# EAGLE design ETHERUNO (EAGLE 9.6.2)

## Sheet 1 of 4
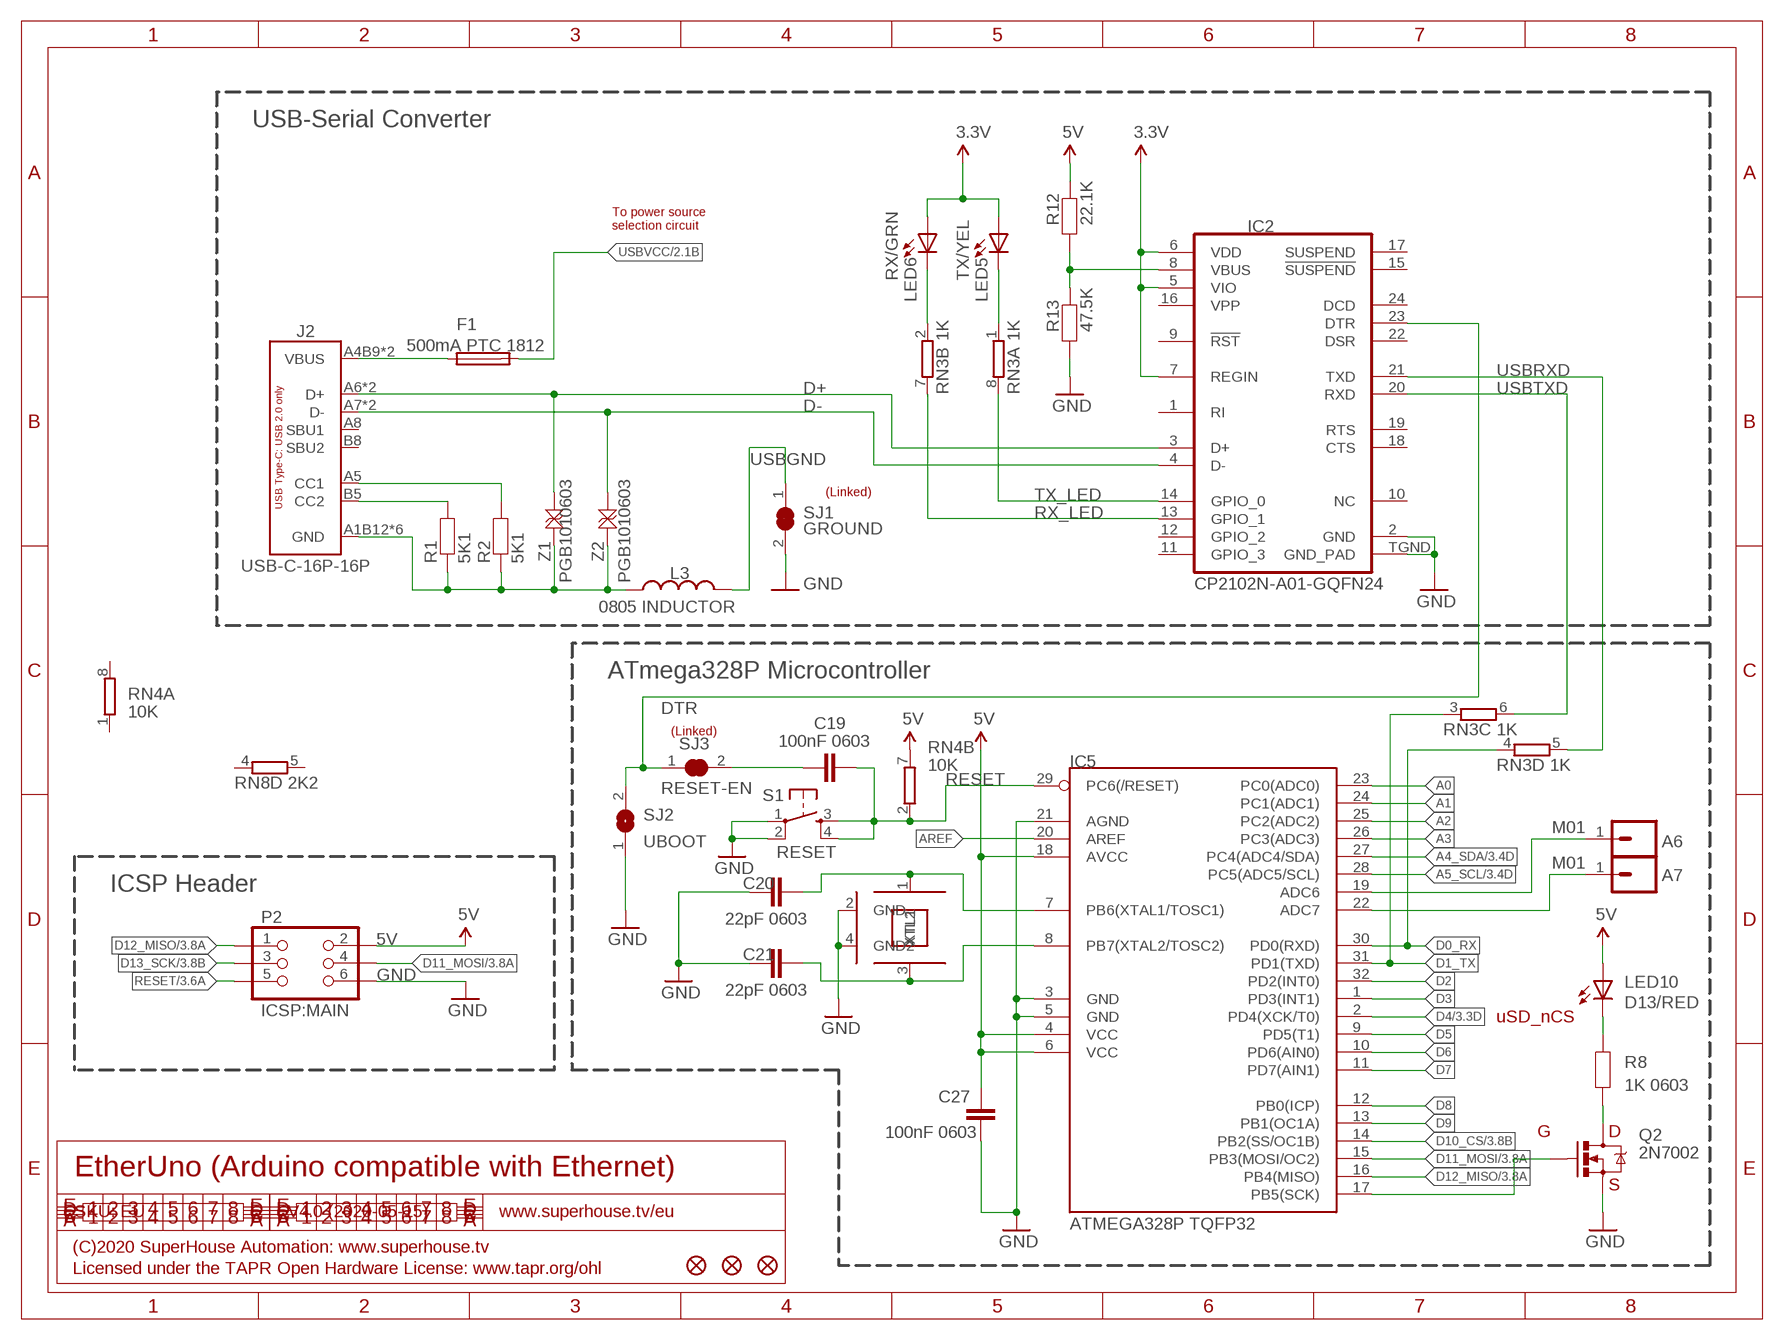
[diagram p0: schematic, sheet 1]

### Parts
A6  M01  M01-PLAIN  [1X01]
A7  M01  M01-PLAIN  [1X01]
C19  100nF 0603  CAP0603  [C0603]
C20  22pF 0603  CAP0603  [C0603]
C21  22pF 0603  CAP0603  [C0603]
C27  100nF 0603  CAP0603  [C0603]
F1  500mA PTC 1812  PTC050  [1812]
FID1  FIDUCIAL1X2.5  [FIDUCIAL-1X2.5]
FID2  FIDUCIAL1X2.5  [FIDUCIAL-1X2.5]
FID3  FIDUCIAL1X2.5  [FIDUCIAL-1X2.5]
IC2  CP2102N-A01-GQFN24  CP2104  [QFN-24]
IC5  ATMEGA328P TQFP32  ATMEGA8-AI  [TQFP32-08]
J2  USB-C-16P-16P  [USB-C-16P]
L3  0805 INDUCTOR  INDUCTOR0805-LARGE  [0805-LARGE]
LED5  TX/YEL  LED0603  [LED-0603]
LED6  RX/GRN  LED0603  [LED-0603]
LED10  D13/RED  LED0603  [LED-0603]
P2  ICSP:MAIN  ICSP-PIN  [2X03-ICSP]
Q2  2N7002  MOSFET-NCHANNEL-233  [SOT23-3]
R1  5K1  RESISTOR0603  [R0603]
R2  5K1  RESISTOR0603  [R0603]
R8  1K 0603  RESISTOR0603  [R0603]
R12  22.1K  RESISTOR0603  [R0603]
R13  47.5K  RESISTOR0603  [R0603]
RN3  1K  4R-NCAY16  [CAY16]
RN4  10K  4R-NCAY16  [CAY16]
RN8  2K2  4R-NCAY16  [CAY16]
S1  RESET  TAC_SWITCH-SMT-6  [TACTILE_SMT-6MM]
SJ1  GROUND  SJC-NORMAL  [SJC]
SJ2  UBOOT  SJ-NORMAL  [SJ]
SJ3  RESET-EN  SJC-NORMAL  [SJC]
U$19  CRYSTAL-GND3X2  [CRYSTAL-SMD-3X2]
Z1  PGB1010603  TVS0603  [TVS0603]
Z2  PGB1010603  TVS0603  [TVS0603]

### Nets
3.3V: IC2.5(VIO) IC2.6(VDD) IC2.7(REGIN) LED5.A LED6.A ; also sheet 2,3,4
5V [power]: C27.1 IC5.4(VCC) IC5.6(VCC) IC5.18(AVCC) LED10.A P2.2 R12.2 RN4.7 ; also sheet 2,3,4
A0: IC5.23(PC0(ADC0)) ; also sheet 4
A1: IC5.24(PC1(ADC1)) ; also sheet 4
A2: IC5.25(PC2(ADC2)) ; also sheet 4
A3: IC5.26(PC3(ADC3)) ; also sheet 4
A4_SDA: IC5.27(PC4(ADC4/SDA)) ; also sheet 3,4
A5_SCL: IC5.28(PC5(ADC5/SCL)) ; also sheet 3,4
AREF: IC5.20(AREF) ; also sheet 4
D0_RX: IC5.30(PD0(RXD)) RN3.4 ; also sheet 4
D1_TX: IC5.31(PD1(TXD)) RN3.3 ; also sheet 4
D2: IC5.32(PD2(INT0)) ; also sheet 4
D3: IC5.1(PD3(INT1)) ; also sheet 4
D4: IC5.2(PD4(XCK/T0)) ; also sheet 3,4
D5: IC5.9(PD5(T1)) ; also sheet 4
D6: IC5.10(PD6(AIN0)) ; also sheet 4
D7: IC5.11(PD7(AIN1)) ; also sheet 4
D8: IC5.12(PB0(ICP)) ; also sheet 4
D9: IC5.13(PB1(OC1A)) ; also sheet 4
D10_CS: IC5.14(PB2(SS/OC1B)) ; also sheet 3,4
D11_MOSI: IC5.15(PB3(MOSI/OC2)) P2.4 ; also sheet 3,4
D12_MISO: IC5.16(PB4(MISO)) P2.1 ; also sheet 3,4
D13_SCK: IC5.17(PB5(SCK)) P2.3 Q2.1(G) ; also sheet 3,4
D+: IC2.3(D+) J2.A6(D+) J2.B6(D+) Z1.1
D-: IC2.4(D-) J2.A7(D-) J2.B7(D-) Z2.1
DTR: IC2.23(DTR) SJ2.2 SJ3.1
GND: C20.1 C21.1 C27.2 IC2.2(GND) IC2.TGND(GND_PAD) IC5.3(GND) IC5.5(GND) IC5.21(AGND) P2.6 Q2.2(S) R13.1 S1.1 S1.2 SJ1.2 SJ2.1 U$19.2(GND) U$19.4(GND2) ; also sheet 2,3,4
N$2: C20.2 IC5.7(PB6(XTAL1/TOSC1)) U$19.1(XTL1)
N$3: C19.1 SJ3.2
N$4: LED10.C R8.2
N$6: Q2.3(D) R8.1
N$7: C21.2 IC5.8(PB7(XTAL2/TOSC2)) U$19.3(XTL2)
N$9: J2.A1B12(GND) J2.A12B1(GND) J2.FIX1(GND) J2.FIX2(GND) J2.FIX3(GND) J2.FIX4(GND) L3.1 R1.1 R2.1 Z1.2 Z2.2
N$10: J2.B5(CC2) R1.2
N$11: LED6.C RN3.2
N$13: LED5.C RN3.1
N$21: A7.1 IC5.22(ADC7)
N$22: A6.1 IC5.19(ADC6)
N$34: J2.A5(CC1) R2.2
N$39: IC2.8(VBUS) R12.1 R13.2
N$115: F1.1 J2.A4B9(VBUS) J2.A9B4(VBUS)
RESET: C19.2 IC5.29(PC6(/RESET)) P2.5 RN4.2 S1.3 S1.4 ; also sheet 3,4
RX_LED: IC2.13(GPIO_1) RN3.7
TX_LED: IC2.14(GPIO_0) RN3.8
USBGND: L3.2 SJ1.1
USBRXD: IC2.21(TXD) RN3.5
USBTXD: IC2.20(RXD) RN3.6
USBVCC: F1.2 ; also sheet 2
Unconnected: IC2.1(RI) IC2.9(!RST) IC2.10(NC) IC2.11(GPIO_3) IC2.12(GPIO_2) IC2.15(!SUSPEND) IC2.16(VPP) IC2.17(SUSPEND) IC2.18(CTS) IC2.19(RTS) IC2.22(DSR) IC2.24(DCD) J2.A8(SBU1) J2.B8(SBU2) RN4.1 RN4.8 RN8.4 RN8.5

### Notes on the sheet
- USB-Serial Converter
- To power source
  selection circuit
- (Linked)
- ATmega328P Microcontroller
- (Linked)
- ICSP Header
- uSD_nCS
- G | D
- EtherUno (Arduino compatible with Ethernet)
- S
- SKU: EU | V4.0 (2020-05-15) | www.superhouse.tv/eu
- (C)2020 SuperHouse Automation: www.superhouse.tv
- Licensed under the TAPR Open Hardware License: www.tapr.org/ohl

## Sheet 2 of 4
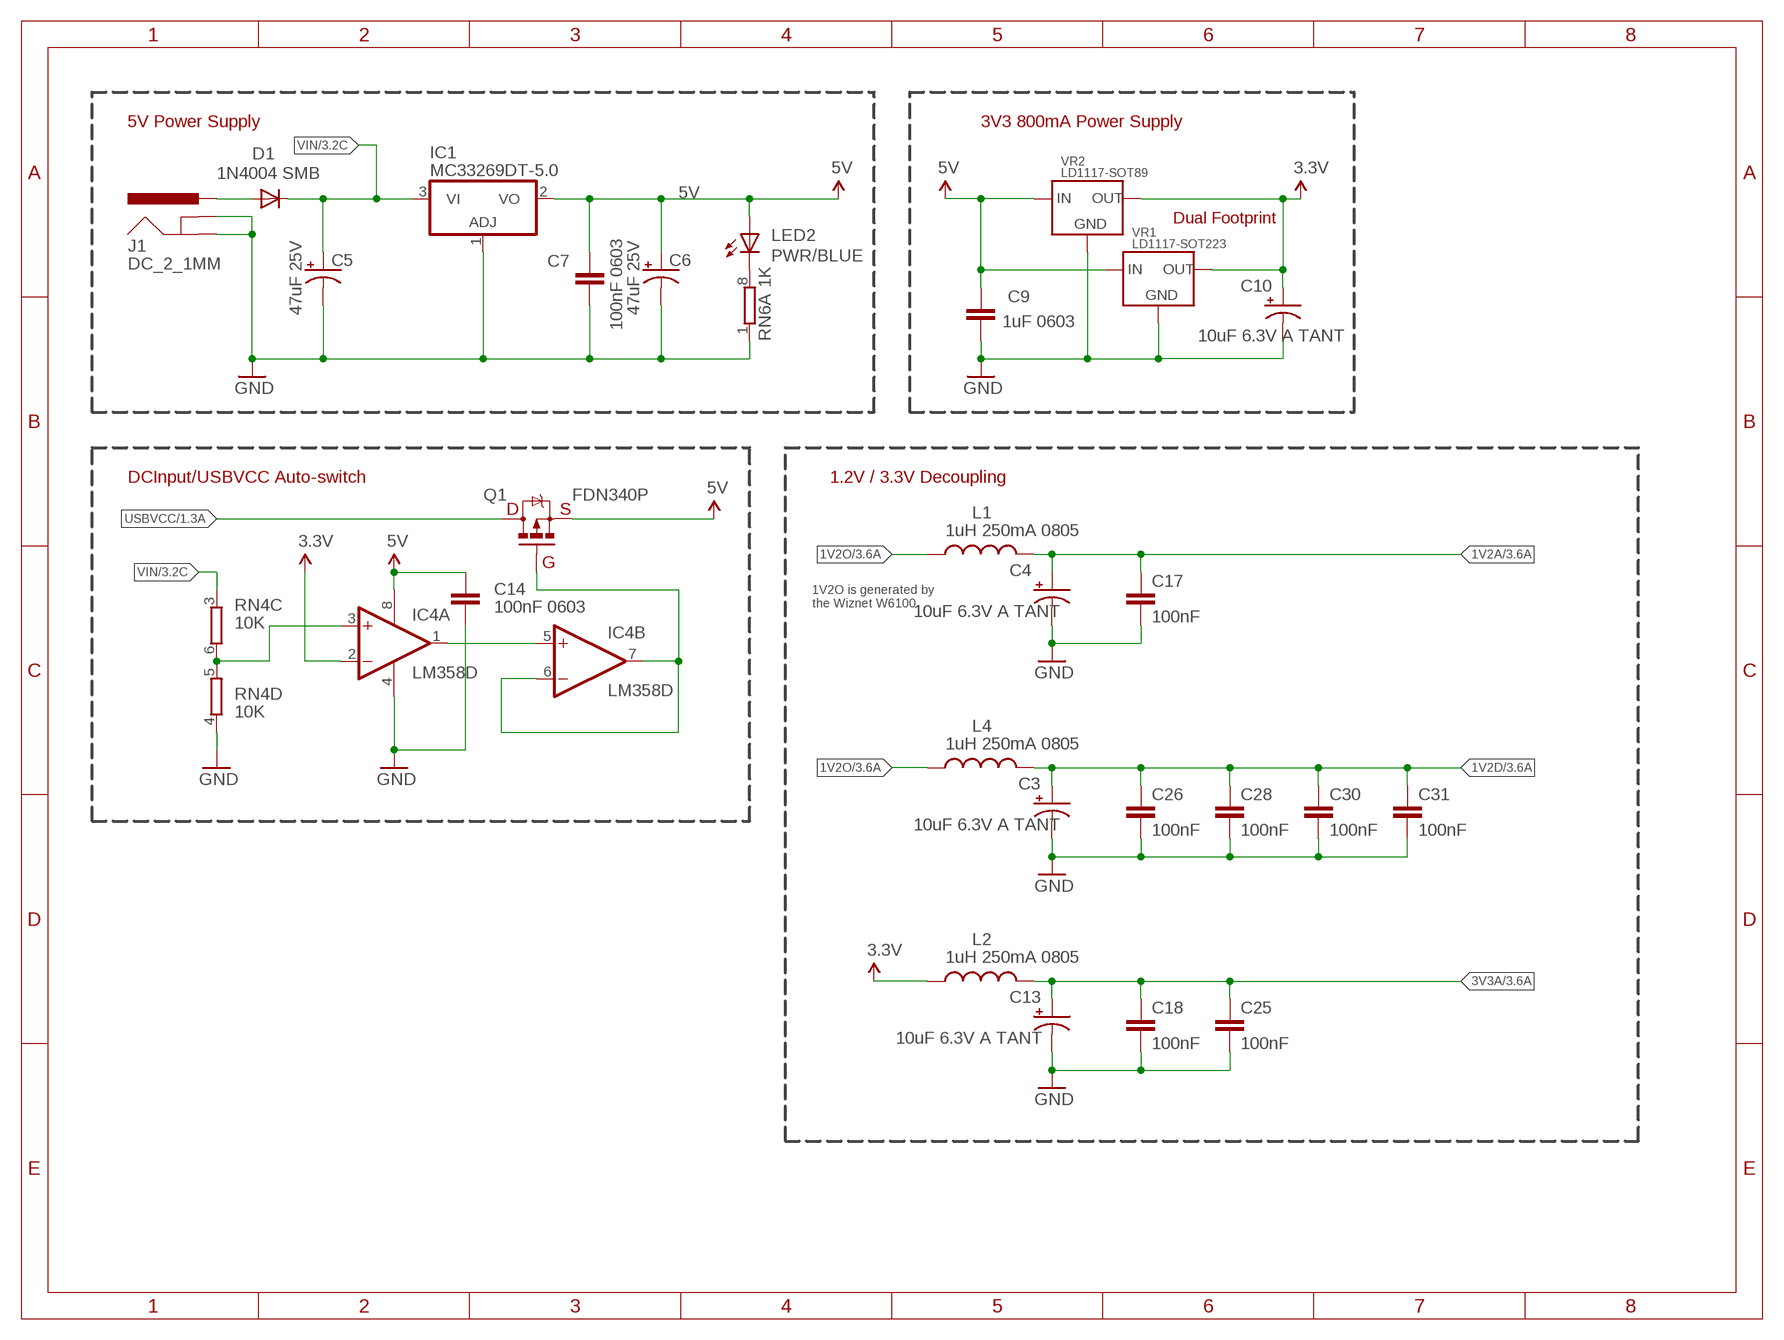
[diagram p1: schematic, sheet 2]

### Parts
C3  10uF 6.3V A TANT  CAP_POL1206  [EIA3216]
C4  10uF 6.3V A TANT  CAP_POL1206  [EIA3216]
C5  47uF 25V  CAP_POLD  [PANASONIC_D]
C6  47uF 25V  CAP_POLD  [PANASONIC_D]
C7  100nF 0603  CAP0603  [C0603]
C9  1uF 0603  CAP0603  [C0603]
C10  10uF 6.3V A TANT  CAP_POL1206  [EIA3216]
C13  10uF 6.3V A TANT  CAP_POL1206  [EIA3216]
C14  100nF 0603  CAP0603  [C0603]
C17  100nF  CAP0603  [C0603]
C18  100nF  CAP0603  [C0603]
C25  100nF  CAP0603  [C0603]
C26  100nF  CAP0603  [C0603]
C28  100nF  CAP0603  [C0603]
C30  100nF  CAP0603  [C0603]
C31  100nF  CAP0603  [C0603]
D1  1N4004 SMB  DIODESMA  [SMA-DIODE]
IC1  MC33269DT-5.0  MC33269-X-5.0-D  [DPACK]
IC4  LM358D  [SO08]
J1  DC_2_1MM  POWER_JACK-SLOTS  [POWER_JACK_SLOTS]
L1  1uH 250mA 0805  INDUCTOR0805-LARGE  [0805-LARGE]
L2  1uH 250mA 0805  INDUCTOR0805-LARGE  [0805-LARGE]
L4  1uH 250mA 0805  INDUCTOR0805-LARGE  [0805-LARGE]
LED2  PWR/BLUE  LED0603  [LED-0603]
Q1  FDN340P  MOSFET-PCHANNEL  [SOT23]
RN6  1K  4R-NCAY16  [CAY16]
VR1  LD1117-SOT223  [SOT-223]
VR2  LD1117-SOT89  [SOT89]

### Nets
1V2A: C4.A(+) C17.1 L1.2 ; also sheet 3
1V2D: C3.A(+) C26.1 C28.1 C30.1 C31.1 L4.2 ; also sheet 3
1V2O: L1.1 L4.1 ; also sheet 3
3.3V: C10.A(+) IC4.2(A:-IN) L2.1 VR1.2(OUT) VR1.4(OUT) VR2.2(OUT) VR2.4(OUT) ; also sheet 1,3,4
3V3A: C13.A(+) C18.1 C25.1 L2.2 ; also sheet 3
5V [power]: C6.+ C7.1 C9.1 C14.1 IC1.2(VO) IC4.8(P:V+) LED2.A Q1.2(S) VR1.3(IN) VR2.3(IN) ; also sheet 1,3,4
GND: C3.C(-) C4.C(-) C5.- C6.- C7.2 C9.2 C10.C(-) C13.C(-) C14.2 C17.2 C18.2 C25.2 C26.2 C28.2 C30.2 C31.2 IC1.1(ADJ) IC4.4(P:V-) J1.GND J1.GNDBREAK RN4.4 RN6.1 VR1.1(GND) VR2.1(GND) ; also sheet 1,3,4
N$12: IC4.3(A:+IN) RN4.5 RN4.6
N$14: LED2.C RN6.8
N$18: IC4.6(B:-IN) IC4.7(B:OUT) Q1.1(G)
N$19: IC4.1(A:OUT) IC4.5(B:+IN)
N$60: D1.A J1.PWR
USBVCC: Q1.3(D) ; also sheet 1
VIN: C5.+ D1.C IC1.3(VI) RN4.3 ; also sheet 3,4

### Notes on the sheet
- 5V Power Supply | 3V3 800mA Power Supply
- Dual Footprint
- DCInput/USBVCC Auto-switch | 1.2V / 3.3V Decoupling
- D | S
- G
- 1V2O is generated by
  the Wiznet W6100

## Sheet 3 of 4
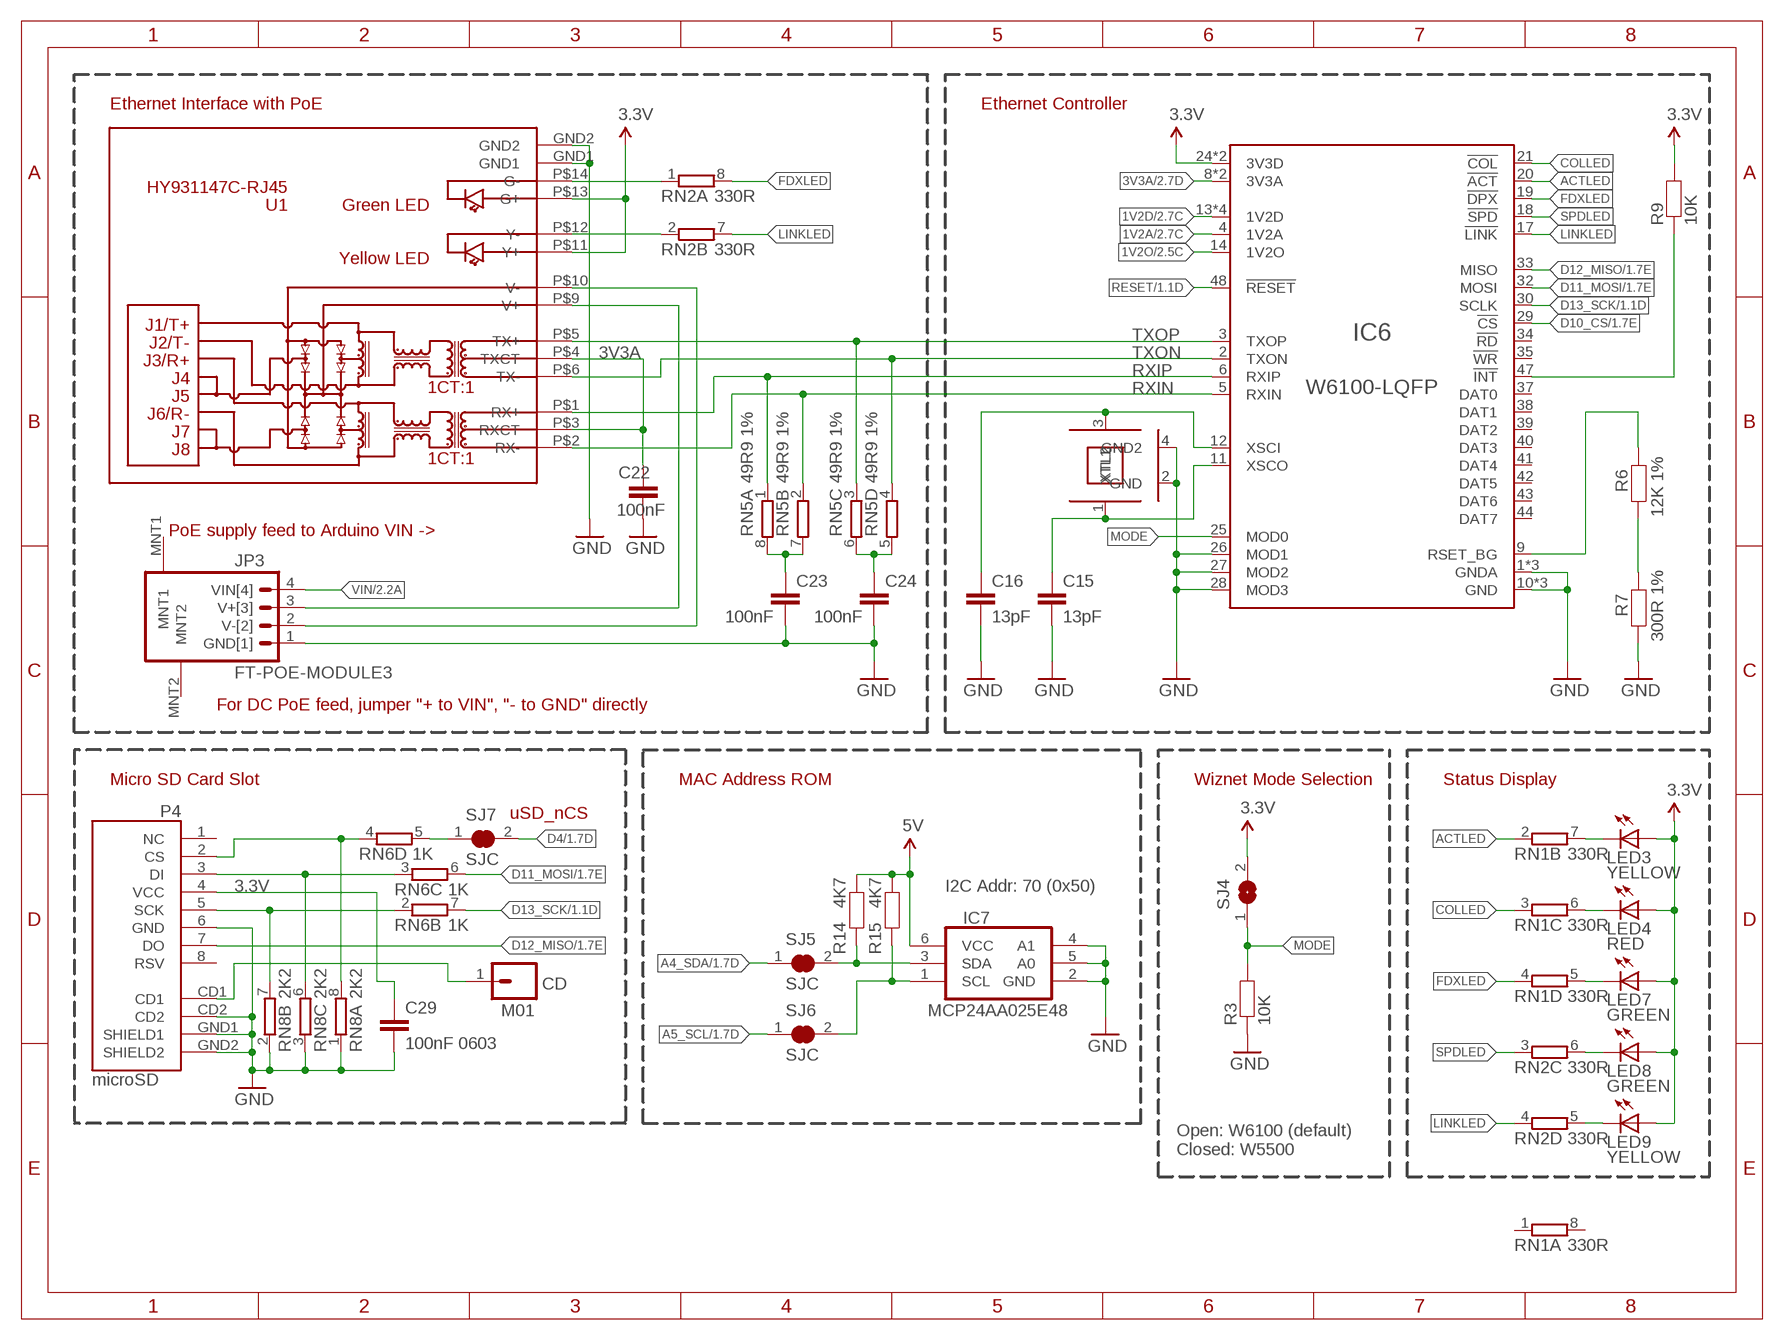
[diagram p2: schematic, sheet 3]

### Parts
C15  13pF  CAP0603  [C0603]
C16  13pF  CAP0603  [C0603]
C22  100nF  CAP0603  [C0603]
C23  100nF  CAP0603  [C0603]
C24  100nF  CAP0603  [C0603]
C29  100nF 0603  CAP0603  [C0603]
CD  M01  M01-PLAIN  [1X01]
IC6  W6100-LQFP  [LQFP48]
IC7  MCP24AA025E48  [SOT23-6]
JP3  FT-POE-MODULE3  [FT-POE-MODULE-NOLABEL]
LED3  YELLOW  LED0603  [LED-0603]
LED4  RED  LED0603  [LED-0603]
LED7  GREEN  LED0603  [LED-0603]
LED8  GREEN  LED0603  [LED-0603]
LED9  YELLOW  LED0603  [LED-0603]
P4  microSD  USD-SOCKETNEW  [MICRO-SD-SOCKET-PP]
R3  10K  RESISTOR0603  [R0603]
R6  12K 1%  RESISTOR0603  [R0603]
R7  300R 1%  RESISTOR0603  [R0603]
R9  10K  RESISTOR0603  [R0603]
R14  4K7  RESISTOR0603  [R0603]
R15  4K7  RESISTOR0603  [R0603]
RN1  330R  4R-NCAY16  [CAY16]
RN2  330R  4R-NCAY16  [CAY16]
RN5  49R9 1%  4R-NCAY16  [CAY16]
SJ4  SJ-NORMAL  [SJ]
SJ5  SJC  SJC-NORMAL  [SJC]
SJ6  SJC  SJC-NORMAL  [SJC]
SJ7  SJC  SJC-NORMAL  [SJC]
U1  HY931147C-RJ45  [HY931147C]
U$17  CRYSTAL-GND3X2  [CRYSTAL-SMD-3X2]

### Nets
1V2A: IC6.4(1V2A) ; also sheet 2
1V2D: IC6.13(1V2D) IC6.22(1V2D) IC6.31(1V2D) IC6.45(1V2D) ; also sheet 2
1V2O: IC6.14(1V2O) ; also sheet 2
3.3V: C29.1 IC6.24(3V3D) IC6.36(3V3D) LED3.A LED4.A LED7.A LED8.A LED9.A P4.4(VCC) R9.2 SJ4.2 U1.P$11(Y+) U1.P$13(G+) ; also sheet 1,2,4
3V3A: C22.1 IC6.8(3V3A) IC6.15(3V3A) U1.P$3(RXCT) U1.P$4(TXCT) ; also sheet 2
5V [power]: IC7.6(VCC) R14.1 R15.1 ; also sheet 1,2,4
A4_SDA: SJ5.1 ; also sheet 1,4
A5_SCL: SJ6.1 ; also sheet 1,4
ACTLED: IC6.20(!ACT) RN1.2
COLLED: IC6.21(!COL) RN1.3
D4: SJ7.2 ; also sheet 1,4
D10_CS: IC6.29(!CS) ; also sheet 1,4
D11_MOSI: IC6.32(MOSI) RN6.6 ; also sheet 1,4
D12_MISO: IC6.33(MISO) P4.7(DO) ; also sheet 1,4
D13_SCK: IC6.30(SCLK) RN6.7 ; also sheet 1,4
FDXLED: IC6.19(!DPX) RN1.4 RN2.8
GND: C15.2 C16.2 C22.2 C23.2 C24.2 C29.2 IC6.1(GNDA) IC6.7(GNDA) IC6.10(GND) IC6.16(GNDA) IC6.23(GND) IC6.26(MOD1) IC6.27(MOD2) IC6.28(MOD3) IC6.46(GND) IC7.2(GND) IC7.4(A1) IC7.5(A0) JP3.1(GND[1]) P4.6(GND) P4.CD2 P4.GND1(SHIELD1) P4.GND2(SHIELD2) R3.1 R7.2 RN8.1 RN8.2 RN8.3 U1.GND1 U1.GND2 U$17.2(GND) U$17.4(GND2) ; also sheet 1,2,4
LINKLED: IC6.17(!LINK) RN2.4 RN2.7
MODE: IC6.25(MOD0) R3.2 SJ4.1
N$1: C24.1 RN5.5 RN5.6
N$5: IC7.1(SCL) R15.2 SJ6.2
N$20: P4.2(CS) RN6.4 RN8.8
N$23: CD.1 P4.CD1
N$24: P4.5(SCK) RN6.2 RN8.7
N$25: P4.3(DI) RN6.3 RN8.6
N$26: LED8.C RN2.6
N$27: RN6.5 SJ7.1
N$28: LED9.C RN2.5
N$29: IC7.3(SDA) R14.2 SJ5.2
N$30: C15.1 IC6.11(XSCO) U$17.1(XTL1)
N$32: C16.1 IC6.12(XSCI) U$17.3(XTL2)
N$35: R6.2 R7.1
N$36: IC6.9(RSET_BG) R6.1
N$37: IC6.47(!INT) R9.1
N$67: RN2.1 U1.P$14(G-)
N$68: JP3.3(V+[3]) U1.P$9(V+)
N$69: JP3.2(V-[2]) U1.P$10(V-)
N$321: C23.1 RN5.7 RN5.8
N$327: LED7.C RN1.5
N$328: LED4.C RN1.6
N$329: LED3.C RN1.7
N$332: RN2.2 U1.P$12(Y-)
RESET: IC6.48(!RESET) ; also sheet 1,4
RXIN: IC6.5(RXIN) RN5.2 U1.P$2(RX-)
RXIP: IC6.6(RXIP) RN5.1 U1.P$1(RX+)
SPDLED: IC6.18(!SPD) RN2.3
TXON: IC6.2(TXON) RN5.4 U1.P$6(TX-)
TXOP: IC6.3(TXOP) RN5.3 U1.P$5(TX+)
VIN: JP3.4(VIN[4]) ; also sheet 2,4
Unconnected: IC6.34(!RD) IC6.35(!WR) IC6.37(DAT0) IC6.38(DAT1) IC6.39(DAT2) IC6.40(DAT3) IC6.41(DAT4) IC6.42(DAT5) IC6.43(DAT6) IC6.44(DAT7) JP3.MNT1 JP3.MNT2 P4.1(NC) P4.8(RSV) RN1.1 RN1.8

### Notes on the sheet
- Ethernet Interface with PoE | Ethernet Controller
- PoE supply feed to Arduino VIN ->
- For DC PoE feed, jumper "+ to VIN", "- to GND" directly
- Micro SD Card Slot | MAC Address ROM | Wiznet Mode Selection | Status Display
- uSD_nCS
- I2C Addr: 70 (0x50)
- Open: W6100 (default)
  Closed: W5500

## Sheet 4 of 4
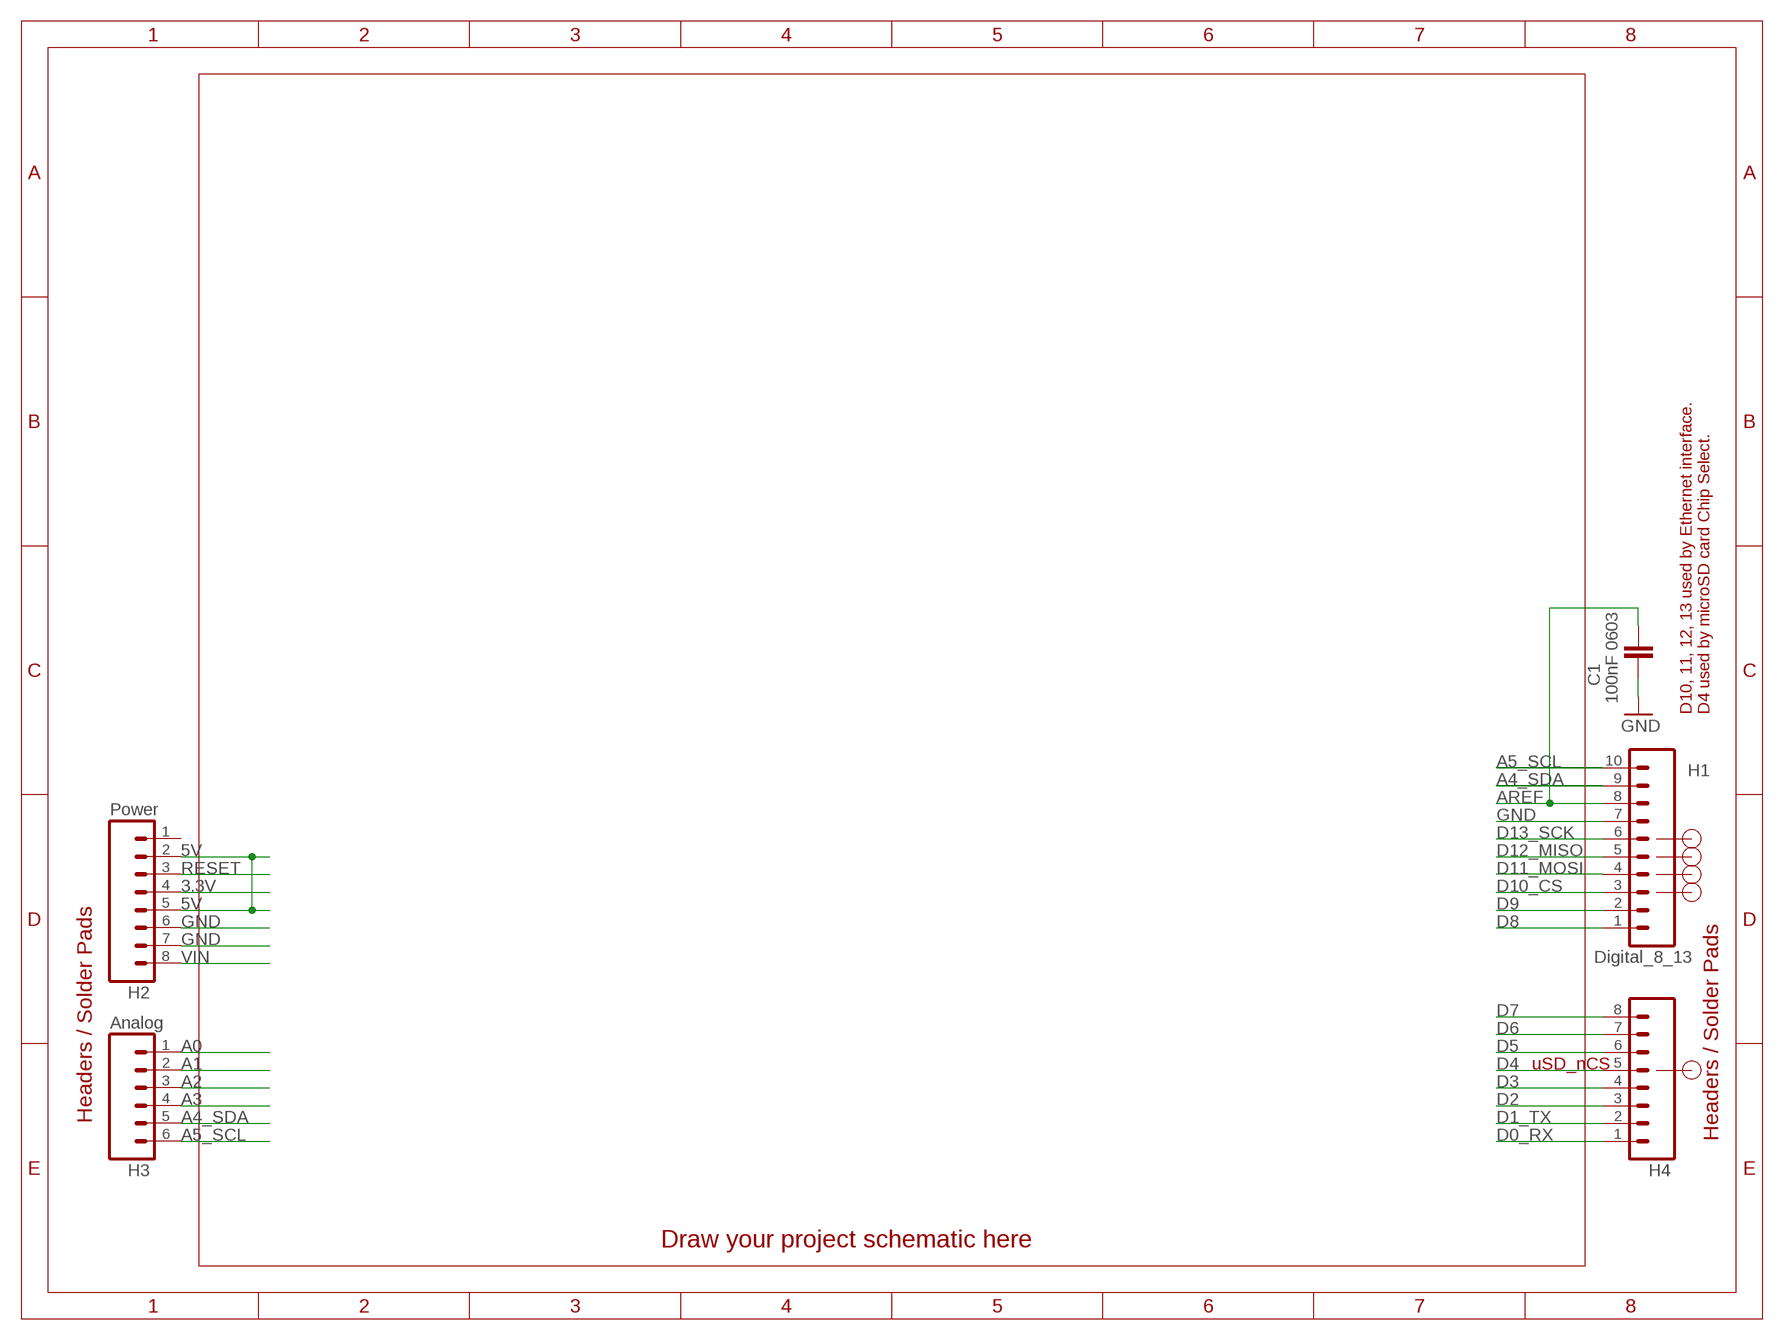
[diagram p3: schematic, sheet 4]

### Parts
C1  100nF 0603  CAP0603  [C0603]
H1  Digital_8_13  M10-SOCKET  [1X10-S]
H2  Power  M08-SOCKET  [1X08-S]
H3  Analog  M06-SOCKET  [1X06-S]
H4  Digital_0_7  M08-SOCKET  [1X08-S]

### Nets
3.3V: H2.4 ; also sheet 1,2,3
5V [power]: H2.2 H2.5 ; also sheet 1,2,3
A0: H3.1 ; also sheet 1
A1: H3.2 ; also sheet 1
A2: H3.3 ; also sheet 1
A3: H3.4 ; also sheet 1
A4_SDA: H1.9 H3.5 ; also sheet 1,3
A5_SCL: H1.10 H3.6 ; also sheet 1,3
AREF: C1.1 H1.8 ; also sheet 1
D0_RX: H4.1 ; also sheet 1
D1_TX: H4.2 ; also sheet 1
D2: H4.3 ; also sheet 1
D3: H4.4 ; also sheet 1
D4: H4.5 ; also sheet 1,3
D5: H4.6 ; also sheet 1
D6: H4.7 ; also sheet 1
D7: H4.8 ; also sheet 1
D8: H1.1 ; also sheet 1
D9: H1.2 ; also sheet 1
D10_CS: H1.3 ; also sheet 1,3
D11_MOSI: H1.4 ; also sheet 1,3
D12_MISO: H1.5 ; also sheet 1,3
D13_SCK: H1.6 ; also sheet 1,3
GND: C1.2 H1.7 H2.6 H2.7 ; also sheet 1,2,3
RESET: H2.3 ; also sheet 1,3
VIN: H2.8 ; also sheet 2,3
Unconnected: H2.1

### Notes on the sheet
- D10, 11, 12, 13 used by Ethernet interface. | D4 used by microSD card Chip Select.
- uSD_nCS
- Headers / Solder Pads
- Headers / Solder Pads
- Draw your project schematic here

## Library data of the parts
A6 A7 CD = SuperHouse-Connectors:M01: 1-way header Standard 1x1 header
C1 C7 C9 C14-C31 = SuperHouse-DiscreteSemi:CAP: Capacitor Standard ceramic capacitor
C3-C6 C10 C13 = SuperHouse-DiscreteSemi:CAP_POL: Capacitor Polarized These are standard SMD and PTH capacitors. Normally 10uF, 47uF, and 100uF in electrolytic and tantalum varieties. Always verify the external diameter of the through hole cap, it varies with capacity, voltage, and manufacturer. The EIA devices should be standard.
D1 = SuperHouse-DiscreteSemi:DIODE: Diode Standard reverse protection diodes and small signal diodes. SMA package can handle up to about 1A. SOD-323 can handle about 200mA.
F1 = SuperHouse-Fuses:PTC: MF-SMDF Series - PRC Resettable Fuses Source: http://www.farnell.com/datasheets/716597.pdf
FID1-FID3 = SuperHouse-Symbols:FIDUCIAL: Fiducial Alignment Points Various fiducial points for machine vision alignment.
H1 = SuperHouse-Connectors:M10: 10-way header Standard 1x10 header, and screw terminal variations
H2 H4 = SuperHouse-Connectors:M08: 8-way header Standard 1x8 header, and screw terminal variations
H3 = SuperHouse-Connectors:M06: 6-way header Standard 1x6 header, and screw terminal variations
IC1 = SuperHouse-Regulators:MC33269-X: Adjustable Output Low Dropout Voltage Regulator 800 mA Source: http://www.onsemi.com/pub/Collateral/MC33269-D.PDF
IC2 = SuperHouse-ICs:CP2104: CP2104 / CP2102N-A01-GQFN24 CP2104 USB to serial converter. The CP2104 is not recommended for new designs: replace with CP2102N-A01-GQFN24.
IC4 = linear:LM358: OP AMP also LM158; LM258; LM2904 Source: http://cache.national.com/ds/LM/LM158.pdf
IC5 = SuperHouse-MCUs:ATMEGA8: MICROCONTROLLER 8 Kbytes FLASH 1 kbytes SRAM 512 bytes EEPROM USART 6-channel 10 bit ADC 2-channel 8 bit ADC
IC6 = SuperHouse-ICs:W6100: Wiznet W6100 Ethernet controller
IC7 = freetronics-jon:MCP24AA025E48
J1 = SuperHouse-Connectors:POWER_JACK: Power Jack This is the standard 5.5mm barrel jack for power. The PTH is the most common, proven, reliable, footprint. All others are experimental. The Slot footprint only works if the mill layer is transmitted to the PCB fab house so be warned. Spark Fun Electronics SKU : PRT-00119. Mating wall wart : TOL-00298 (and others)
J2 = SuperHouse-Connectors:USB-C-16P: USB-C socket with 16 pins, suitable only for backward compatibility with USB 2
JP3 = freetronics-master-v1.1:FT-POE-MODULE
L1-L4 = SuperHouse-DiscreteSemi:INDUCTOR: Inductors Basic Inductor/Choke - 0603 and 1206. Footprints are not proven and vary greatly between part numbers.
LED2-LED10 = SuperHouse-LEDs:LED: LEDs Standard schematic elements and footprints for 5mm, 3mm, 1206, and 0603 sized LEDs. 5mm - Spark Fun Electronics SKU : COM-00529 (and others)
P2 = SuperHouse-Connectors:ICSP
P4 = SuperHouse-Connectors:USD-SOCKET: microSD Socket Push-push type uSD socket. Schematic element and footprint production proven. Spark Fun Electronics SKU : PRT-00127. tDoc lines correctly indicate media card edge positions when inserting (unlocked, locked, depressed).
Q1 = freetronics-master-v1:MOSFET-PCHANNEL
Q2 = SuperHouse-DiscreteSemi:MOSFET-NCHANNEL: N-channel MOSFET
R1-R3 R6-R9 R12-R15 = SuperHouse-DiscreteSemi:RESISTOR: Resistor Standard resistors.
RN1-RN6 RN8 = SuperHouse-DiscreteSemi:4R-N: Array Chip Resistor Source: RS Component / Phycomp
S1 = SuperHouse-Switches:TAC_SWITCH: Momentary Switch Tactile switch, normally-open.
SJ1 SJ3 SJ5-SJ7 = SuperHouse-Jumpers:SJC: Solder jumper. Normally closed: does not need solder to close. Can be opened by cutting the track.
SJ2 SJ4 = SuperHouse-Jumpers:SJ: SMD solder jumper, normally-open. Add solder to close the connection.
U1 = SuperHouse-Connectors:HY931147C: Hanrun RJ45 socket HY931147C
U$17 U$19 = SuperHouse-Oscillators:CRYSTAL-GND: 3x2mm SMT crystal
VR1 VR2 = SuperHouse-Regulators:LD1117: Fixed-voltage LD1117 series LDOs. Note that the ground pin is labelled as ground, not as adj, because it's not the adjustable-voltage part.
Z1 Z2 = SuperHouse-DiscreteSemi:TVS: TVS voltage protection Zener

## Board
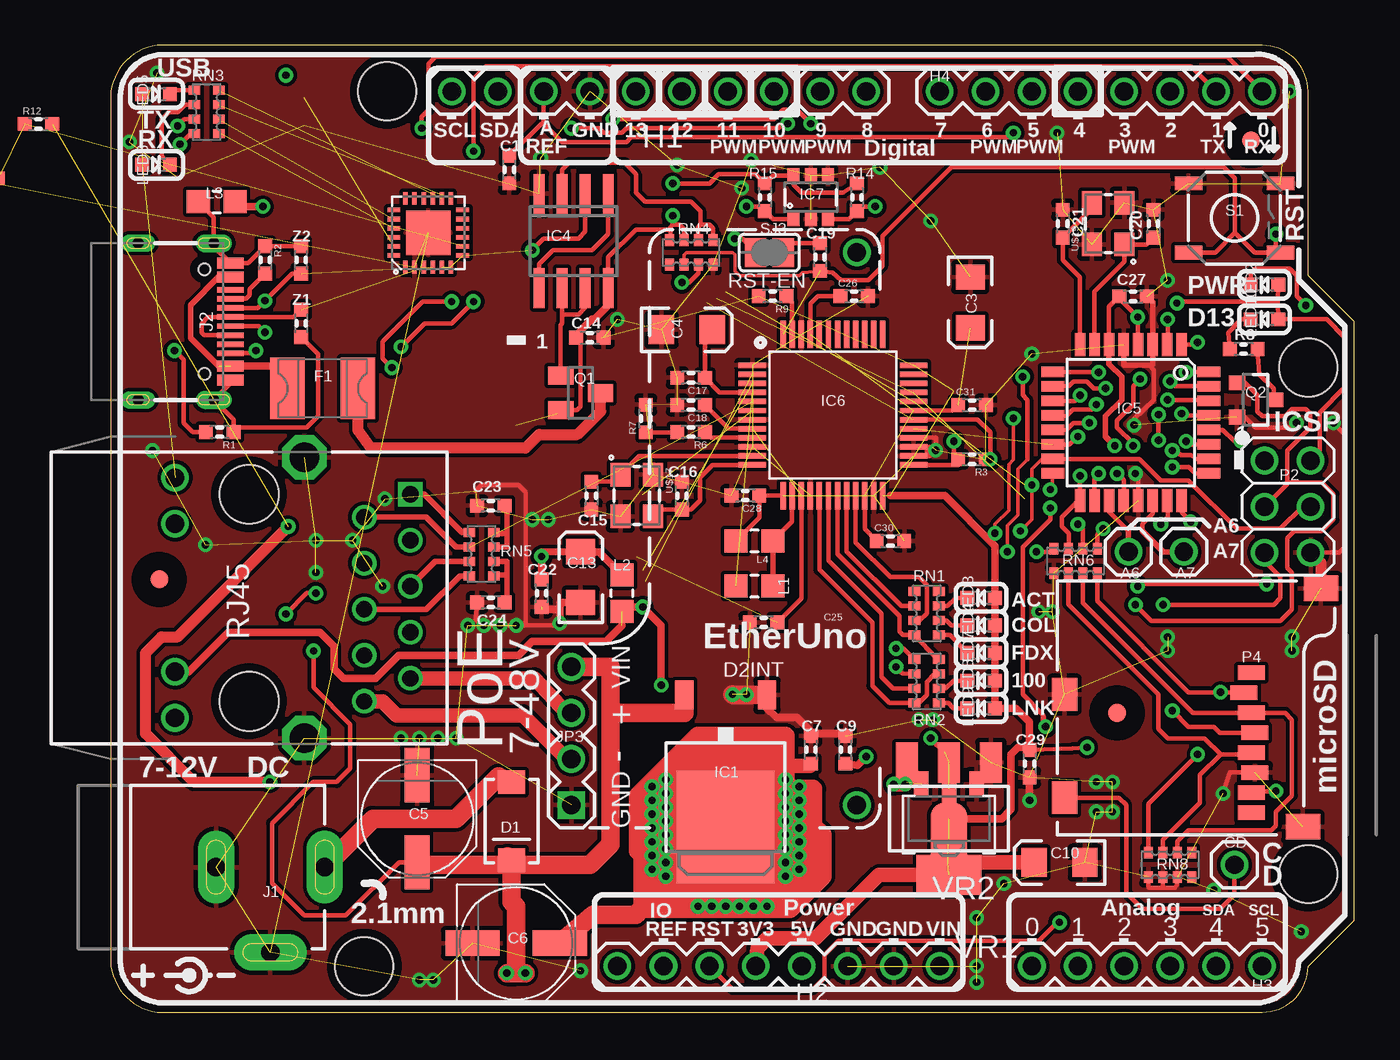
[diagram p4: board, top side]
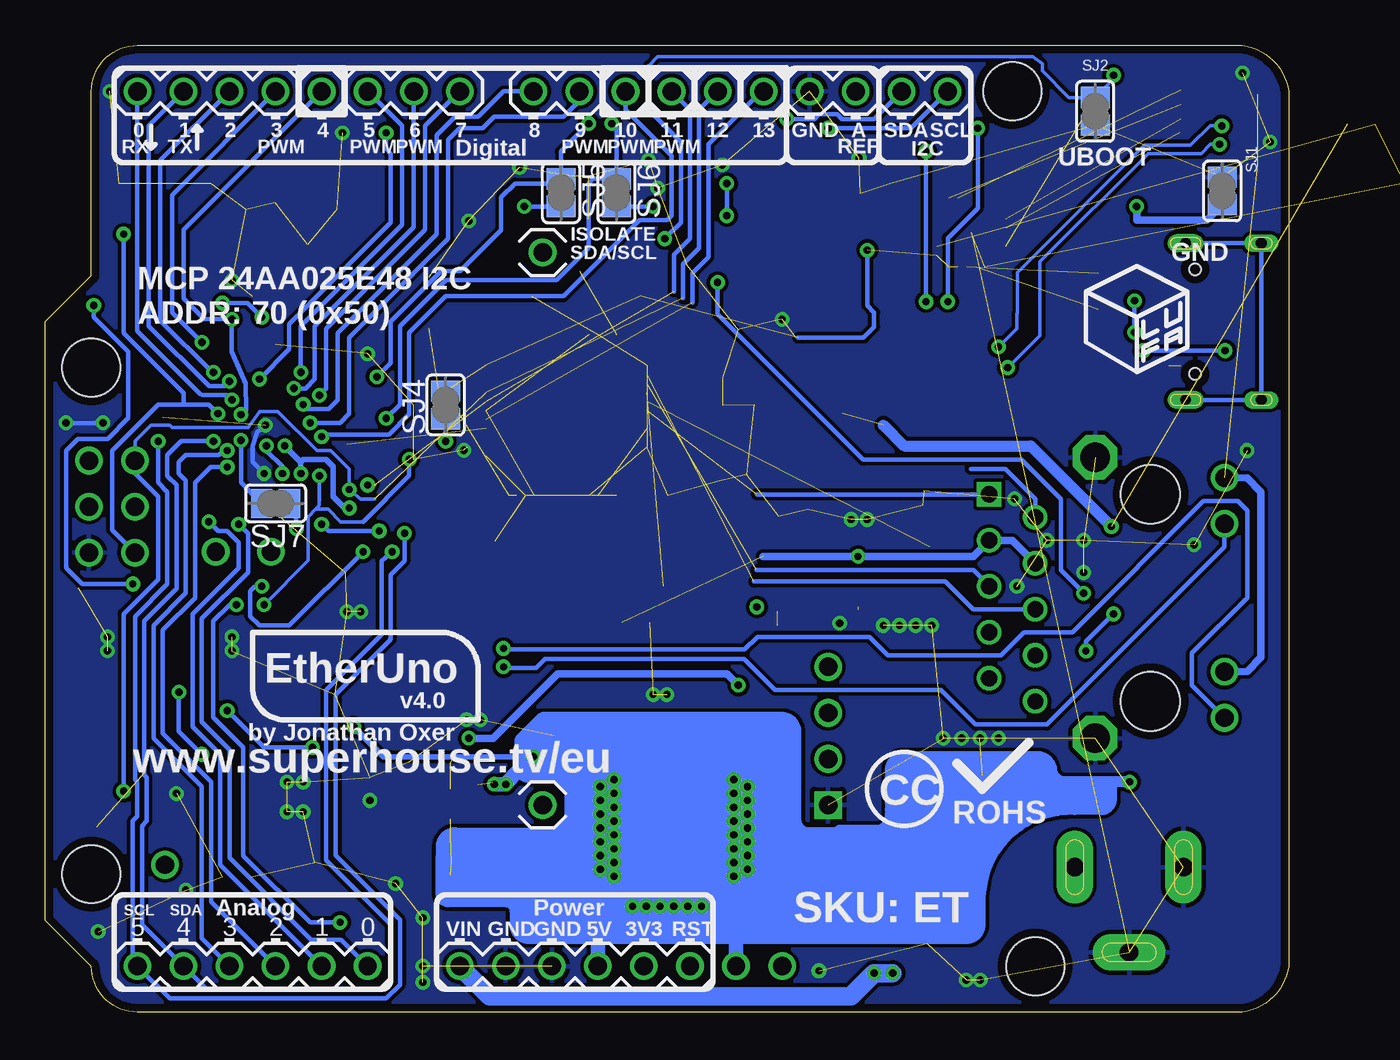
[diagram p5: board, bottom side, seen from below]

Size 68.58 x 53.34 mm. Coordinates in mm from the lower left corner, seen from the top.
Outline: 0,2.54 arc74 2.54,0 63.5,0 arc90 66.04,2.54 68.58,5.08 68.58,38.1 66.04,40.64 66.04,50.8 arc90 63.5,53.34 2.54,53.34 arc74 0,50.8 0,2.54
Copper layers (1*16): Top 0.035mm / dielectric 1.5mm / Bottom 0.035mm
Design rules "SuperHouse-Design-Rules": minimum track width 10mil, minimum drill 24mil, track to track 8mil, track to pad 8mil, pad to pad 8mil, via to via 8mil, smd to smd 6mil, copper to edge 18mil, drill to drill 8mil, minimum pad ring 7mil, minimum via ring 8mil, stop-mask expansion 4mil, vias tented up to drill 0.5mm, thermal gap 10mil
Holes 3.2 mm at 66.04,35.56 66.04,7.62 13.97,2.54 15.24,50.8
tRestrict: area 61.9,47.1 to 63.9,49.1; area 54.5,15.5 to 56.5,17.5; area 1.7,22.9 to 3.7,24.9

### Footprints (pad centres in the part's own frame; a part is rotated, then mirrored left to right if it is on the bottom)
1X01 = drill 1.016: 1 0,0
C0603 = smd 0.762 x 0.762: 1 -0.762,0; 2 0.762,0
EIA3216 = smd 1.4 x 1.6: A 1.4,0; C -1.4,0
PANASONIC_D = smd 3 x 1.4: + 2.4,0; - -2.4,0
SMA-DIODE = smd 1.27 x 1.47: A -2.15,0; C 2.15,0
1812 = smd 1.9 x 3.4: 1 -1.95,0; 2 1.95,0
FIDUCIAL-1X2.5 = smd 1 x 1: 1 0,0
1X10-S = drill 1.016: 1 -11.43,0; 2 -8.89,0; 3 -6.35,0; 4 -3.81,0; 5 -1.27,0; 6 1.27,0; 7 3.81,0; 8 6.35,0; 9 8.89,0; 10 11.43,0
1X08-S = drill 1.016: 1 -8.89,0; 2 -6.35,0; 3 -3.81,0; 4 -1.27,0; 5 1.27,0; 6 3.81,0; 7 6.35,0; 8 8.89,0
1X06-S = drill 1.016: 1 -6.35,0; 2 -3.81,0; 3 -1.27,0; 4 1.27,0; 5 3.81,0; 6 6.35,0
DPACK = smd 1 x 1.6: 1 -2.28,-4.8; 3 2.28,-4.8 | smd 5.4 x 6.2: 2 0,2.5
QFN-24 = smd 0.25 x 0.7: 1 -1.25,-1.9; 2 -0.75,-1.9; 3 -0.25,-1.9; 4 0.25,-1.9; 5 0.75,-1.9; 6 1.25,-1.9; 13 1.25,1.9; 14 0.75,1.9; 15 0.25,1.9; 16 -0.25,1.9; 17 -0.75,1.9; 18 -1.25,1.9 | smd 0.7 x 0.25: 7 1.9,-1.25; 8 1.9,-0.75; 9 1.9,-0.25; 10 1.9,0.25; 11 1.9,0.75; 12 1.9,1.25; 19 -1.9,1.25; 20 -1.9,0.75; 21 -1.9,0.25; 22 -1.9,-0.25; 23 -1.9,-0.75; 24 -1.9,-1.25 | smd 2.45 x 2.45: TGND 0,0
SO08 = smd 0.6 x 2.2: 1 -1.905,-2.6; 2 -0.635,-2.6; 3 0.635,-2.6; 4 1.905,-2.6; 5 1.905,2.6; 6 0.635,2.6; 7 -0.635,2.6; 8 -1.905,2.6
TQFP32-08 = smd 1.27 x 0.559: 1 -4.293,2.8; 2 -4.293,2; 3 -4.293,1.2; 4 -4.293,0.4; 5 -4.293,-0.4; 6 -4.293,-1.2; 7 -4.293,-2; 8 -4.293,-2.8; 17 4.293,-2.8; 18 4.293,-2; 19 4.293,-1.2; 20 4.293,-0.4; 21 4.293,0.4; 22 4.293,1.2; 23 4.293,2; 24 4.293,2.8 | smd 0.559 x 1.27: 9 -2.8,-4.293; 10 -2,-4.293; 11 -1.2,-4.293; 12 -0.4,-4.293; 13 0.4,-4.293; 14 1.2,-4.293; 15 2,-4.293; 16 2.8,-4.293; 25 2.8,4.293; 26 2,4.293; 27 1.2,4.293; 28 0.4,4.293; 29 -0.4,4.293; 30 -1.2,4.293; 31 -2,4.293; 32 -2.8,4.293
LQFP48 = smd 1.5 x 0.3: 1 -4.45,2.75; 2 -4.45,2.25; 3 -4.45,1.75; 4 -4.45,1.25; 5 -4.45,0.75; 6 -4.45,0.25; 7 -4.45,-0.25; 8 -4.45,-0.75; 9 -4.45,-1.25; 10 -4.45,-1.75; 11 -4.45,-2.25; 12 -4.45,-2.75; 25 4.45,-2.75; 26 4.45,-2.25; 27 4.45,-1.75; 28 4.45,-1.25; 29 4.45,-0.75; 30 4.45,-0.25; 31 4.45,0.25; 32 4.45,0.75; 33 4.45,1.25; 34 4.45,1.75; 35 4.45,2.25; 36 4.45,2.75 | smd 0.3 x 1.5: 13 -2.75,-4.45; 14 -2.25,-4.45; 15 -1.75,-4.45; 16 -1.25,-4.45; 17 -0.75,-4.45; 18 -0.25,-4.45; 19 0.25,-4.45; 20 0.75,-4.45; 21 1.25,-4.45; 22 1.75,-4.45; 23 2.25,-4.45; 24 2.75,-4.45; 37 2.75,4.45; 38 2.25,4.45; 39 1.75,4.45; 40 1.25,4.45; 41 0.75,4.45; 42 0.25,4.45; 43 -0.25,4.45; 44 -0.75,4.45; 45 -1.25,4.45; 46 -1.75,4.45; 47 -2.25,4.45; 48 -2.75,4.45
SOT23-6 = smd 0.65 x 0.8: 1 -0.95,-1.2; 2 0,-1.2; 3 0.95,-1.2; 4 0.95,1.2; 5 0,1.2; 6 -0.95,1.2
POWER_JACK_SLOTS = drill 1 pad 2 long: GND 0,7.7; GNDBREAK 4.7,10.7; PWR 0,13.7
USB-C-16P = smd 0.6 x 1.45: A1B12 -3.225,5.095; A4B9 -2.45,5.095; A9B4 2.45,5.095; A12B1 3.225,5.095 | smd 0.3 x 1.45: A5 -1.25,5.095; A6 -0.25,5.095; A7 0.25,5.095; A8 1.25,5.095; B5 1.75,5.095; B6 0.75,5.095; B7 -0.75,5.095; B8 -1.75,5.095 | drill 0.6 pad 0.8 long: FIX1 -4.32,0; FIX4 4.32,0 | drill 0.6 pad 1 long: FIX2 -4.32,4.18; FIX3 4.32,4.18 | hole 0.65: 2.89,3.65; -2.89,3.65
FT-POE-MODULE-NOLABEL = drill 1.016 square: 1 0,0 | drill 1.016: 2 2.54,0; 3 5.08,0; 4 7.62,0; MNT1 0,-15.748; MNT2 30.48,-15.748
0805-LARGE = smd 1.27 x 1.27: 1 -1.016,0; 2 1.016,0
LED-0603 = smd 0.762 x 0.762: A -0.762,0; C 0.762,0
2X03-ICSP = drill 1.016: 1 -2.54,-1.27; 2 -2.54,1.27; 3 0,-1.27; 4 0,1.27; 5 2.54,-1.27; 6 2.54,1.27
MICRO-SD-SOCKET-PP = smd 0.8 x 1.5: 1 -8.94,10.7; 2 -7.84,10.3; 3 -6.74,10.7; 4 -5.64,10.9; 5 -4.54,10.7; 6 -3.44,10.9; 7 -2.34,10.7; 8 -1.24,10.7 | smd 1.8 x 1.4: CD1 -2.05,0.4; CD2 -7.75,0.4 | smd 1.4 x 1.9: GND1 -0.45,13.55; GND2 -13.6,14.55
SOT23 = smd 1 x 1.4: 1 -0.95,-1.1; 2 0.95,-1.1; 3 0,1.1
SOT23-3 = smd 0.8 x 0.9: 1 -0.95,-1; 2 0.95,-1; 3 0,1.1
R0603 = smd 0.762 x 0.762: 1 -0.762,0; 2 0.762,0
CAY16 = smd 0.5 x 0.65: 1 -1.2,-0.675; 2 -0.4,-0.675; 3 0.4,-0.675; 4 1.2,-0.675; 5 1.2,0.675; 6 0.4,0.675; 7 -0.4,0.675; 8 -1.2,0.675
TACTILE_SMT-6MM = smd 1.524 x 0.762: 1 -2.54,1.905; 2 2.54,1.905; 3 -2.54,-1.905; 4 2.54,-1.905
SJC = smd 1.168 x 1.6: 1 -0.762,0; 2 0.762,0
SJ = smd 1.168 x 1.6: 1 -0.762,0; 2 0.762,0
HY931147C = drill 1.63 octagon: GND1 3.05,7.745; GND2 3.05,-7.745 | drill 0.9 square: P$1 8.89,5.715 | drill 0.9: P$2 6.35,4.445; P$3 8.89,3.175; P$4 6.35,1.905; P$5 8.89,0.635; P$6 6.35,-0.635; P$7 8.89,-1.905; P$8 6.35,-3.175; P$9 8.89,-4.445; P$10 6.35,-5.715 | drill 1.016: P$11 -4.08,6.625; P$12 -4.08,4.085; P$13 -4.08,-4.085; P$14 -4.08,-6.625 | hole 3.25: 0,5.715; 0,-5.715
CRYSTAL-SMD-3X2 = smd 1.3 x 1.1: 1 -1.15,-0.9; 2 1.15,-0.9; 3 1.15,0.9; 4 -1.15,0.9
SOT-223 = smd 1.219 x 2.235: 1 -2.311,-3.099; 2 0,-3.099; 3 2.311,-3.099 | smd 3.6 x 2.2: 4 0,3.099
SOT89 = smd 0.8 x 1.4: 1 -1.524,-1.905; 3 1.524,-1.905 | smd 0.8 x 1.9: 2 0,-1.651 | smd 2.032 x 3.65: 4 0,0.94
TVS0603 = smd 0.762 x 0.762: 1 -0.762,0; 2 0.762,0

### Placement (x,y rotation side)
A6  56.13,25.4 0 top
A7  59.18,25.4 0 top
C1  21.97,46.48 270 top
C3  47.4,39.15 270 top
C4  31.77,37.65 0 top
C5  16.89,10.67 270 top
C6  22.35,3.81 0 top
C7  38.61,14.48 90 top
C9  40.51,14.48 90 top
C10  52.32,8.26 180 top
C13  25.91,24 90 top
C14  26.42,37.21 0 top
C15  26.5,28.5 270 top
C16  31.5,28.5 90 top
C17  32,35 180 top
C18  32,33.5 180 top
C19  39.12,41.66 270 top
C20  57.5,43.5 270 top
C21  52.5,43.5 270 top
C22  23.75,23.11 270 top
C23  20.95,27.94 180 top
C24  20.95,22.61 180 top
C25  36,21.5 180 top
C26  41,39.5 0 top
C27  56.38,39.49 0 top
C28  35,28.5 180 top
C29  50.67,13.72 270 top
C30  43,26 0 top
C31  47.5,33.5 0 top
CD  61.98,8.13 0 top
D1  22.1,10.54 270 top
F1  11.68,34.42 0 top
FID1  62.9,48.1 0 top
FID2  55.5,16.51 0 top
FID3  2.67,23.88 0 top
H1  30.23,50.8 180 top
H2  36.83,2.54 0 top
H3  57.15,2.54 0 top
H4  54.61,50.8 180 top
IC1  33.91,12.7 180 top
IC2  17.5,43 0 top
IC4  25.53,42.55 180 top
IC5  56.26,32.53 270 top
IC6  39.83,32.94 0 top
IC7  38.61,44.96 0 top
J1  -1.91,8 270 top
J2  1.5,38.1 270 top
JP3  25.4,11.43 90 top
L1  35.5,23.5 180 top
L2  28.19,23.11 90 top
L3  5.84,44.7 0 top
L4  35.5,26 180 top
LED2  63.63,40.13 180 top
LED3  48.01,22.86 180 top
LED4  48.01,21.34 180 top
LED5  2.5,50.65 0 top
LED6  2.5,46.76 0 top
LED7  48.01,19.81 180 top
LED8  48.01,18.29 180 top
LED9  48.01,16.76 180 top
LED10  63.63,38.23 180 top
P2  64.91,27.89 270 top
P4  52.2,9.78 270 top
Q1  25.91,34.16 270 top
Q2  63.12,33.78 270 top
R1  6,32 180 top
R2  8.5,41.5 270 top
R3  47.5,30.5 180 top
R6  32,32 180 top
R7  29.5,32.75 90 top
R8  62.48,36.58 180 top
R9  36.5,39.5 180 top
R12  -4,49 0 top  (outside the outline)
R13  -7,46 0 top  (outside the outline)
R14  41.15,44.96 270 top
R15  36.07,44.96 270 top
RN1  45,22 270 top
RN2  45,18.25 270 top
RN3  5.28,49.66 270 top
RN4  32,41.91 0 top
RN5  20.45,25.27 270 top
RN6  53.21,24.89 0 top
RN8  58.42,8.13 0 top
S1  61.98,43.81 0 top
SJ1  3.66,45.31 90 bottom
SJ2  10.67,49.7 90 bottom
SJ3  36.32,41.91 0 top
SJ4  46.5,33.5 90 bottom
SJ5  40.13,45.21 270 bottom
SJ6  37.08,45.21 270 bottom
SJ7  55.88,28.07 180 bottom
U1  7.62,22.86 0 top
U$17  29,28.5 270 top
U$19  55,43.5 90 top
VR1  46.23,10.67 180 top
VR2  46.23,10.67 180 top
Z1  10.5,38 270 top
Z2  10.5,41.5 90 top

### Tracks (layer width: path | path; a pad name or v marks a point on that pad's centre or on a via)
1V2A  (1 unrouted)
  Top 0.254: IC6.4 33.57,34.19 C17.1 32.76,37.25 C4.A
1V2D  (4 unrouted)
  Top 0.254: IC6.13 35.77,28.49 C28.1 35.76,27.28 L4.2 | IC6.31 46.43,33.19 C31.1 | C30.1 41.58,26.66 IC6.22 | IC6.45 38.58,39.08 39,39.5 C26.1
1V2O
  Top 0.254: IC6.14 37.58,27.06 L4.1
  Top 0.305: L4.1 L1.1
3.3V  (via drill 0.4)  (16 unrouted)
  Top 0.254: VR2.4 VR1.2 | IC4.2 26.16,43.05 25.78,42.67 23.88,42.67 v23.24,42.04 | P4.4 61.16,15.42 60.83,15.75 59.44,15.75 v58.55,16.64 | v53.85,14.61 53.05,14.57 C29.1
  Top 0.305: v45.21,15.11 45.97,14.35
  Top 0.406: U1.P$13 4.3,18.77 6.48,20.95 11.55,20.95 12.32,20.18 12.32,18.92 12.83,18.41 14.61,18.41 15.88,19.68 22.48,19.68 23.24,20.45 27.3,20.45 28.19,21.34 | 46.23,10.67 49.15,10.67 49.66,11.18 49.66,14.22 50.04,14.61 50.63,14.61 C29.1 50.67,16 49.91,16.76 LED9.A LED8.A LED7.A LED4.A LED3.A 48.77,25.73 46,28.5 43,28.5 | v30.35,18.03 30.35,21.34 v29.34,22.35 28.45,22.35 L2.1
  Top 0.813: 46.18,8.26 C10.A | H2.4 35.66,3.53 36.2,4.06 38.86,4.06 42.37,7.57 VR1.4
  Bottom 0.254: v23.24,42.04 23.24,38.99 22.86,38.61 22.86,37.8 23.44,37.21 27.05,37.21 | v58.55,16.64 56.52,14.61 v53.85,14.61
  Bottom 0.406: U1.P$13 2.29,18.8 1.52,19.56 1.52,28.7 2.29,29.46 U1.P$11 | v30.35,18.03 30.99,18.67 40.33,18.67 43.89,15.11 v45.21,15.11
3V3A  (via drill 0.4)  (2 unrouted)
  Top 0.254: IC6.8 34.07,32.19 C18.1 | IC6.15 38.08,22.82 C25.1
  Top 0.406: L2.2 26.92,25.4 25.27,25.4 C13.A 23.75,25.4 | v23.75,25.15 23.75,25.4 | 23.75,25.4 C22.1
  Bottom 0.406: U1.P$4 15.24,26.04 U1.P$3 17.4,25.15 v23.75,25.15 28.98,25.15
5V  (via drill 0.4)  (3 unrouted)
  Top 0.203: IC1.2 34.04,10.2 34.04,10.16 | 37.21,13.59 37.08,13.59 v37.21,12.83 | 37.85,12.45 v37.97,12.45 37.97,12.32
  Top 0.254: 64.38,39.19 LED10.A 67.06,38.23 68.07,37.21 68.07,34.48 66.67,33.08 66.67,30.99 66.18,30.49 P2.2 | 64.38,39.19 LED2.A | IC5.18 54.26,29.5 v54.48,29.72 | RN4.7 31.6,43.2 31.37,43.43 30.99,43.43 | 30.99,43.43 30.86,43.31 30.86,43.18 | 30.86,43.18 30.86,42.64 | IC4.8 27.43,41.66 28.96,43.18 30.86,43.18 | C14.1 25.91,36.87 25.91,33.4 25.72,33.21 Q1.2 | 64.38,39.19 58.85,39.19 v58.8,39.12 | 29.84,10.41 v29.84,10.16 | 29.72,9.78 29.84,9.65 v29.84,9.4 | v29.84,7.87 v29.84,8.64 30.23,8.64 | 36.45,6.48 36.7,6.48 36.83,6.35 36.45,6.35 | v51.82,27.81 51.82,27.18 50.29,25.65 50.29,17.53 51.44,16.38 51.44,16.26 | R14.1 40.39,45.21 38.1,45.21 37.66,45.65 IC7.6 36.51,46.16 R15.1 35.56,46.23 33.53,46.23 33.02,45.72 v30.99,45.72 | v30.99,43.94 30.99,43.43 | IC5.4 56.64,36.84 v56.64,38.35 55.62,39.37 C27.1 55.06,38.93 IC5.6 | VR1.3 44.7,12.98 VR2.3
  Top 0.305: IC5.6 55.06,35.74 55.75,35.05 55.75,33.78 54.86,32.89 54.86,31.75 v55.37,31.24 | 51.44,16.26 51.44,15.88 v51.56,15.75
  Top 0.406: 38.57,13.59 C7.1 | C9.1 41.19,13.63 v41.66,14.1 | IC4.8 27.43,38.99 26.67,38.23 26.54,38.23 25.57,37.25 C14.1
  Top 0.61: 24.61,33.02 Q1.2 | v9.78,26.8 3.68,20.7 2.79,20.7 1.91,19.81 1.91,15.37 4.57,12.7 v8.76,12.7 | v36.2,5.84 v35.43,5.84 v34.67,5.84 v33.91,5.84 v33.15,5.84 v32.38,5.84 | v36.2,5.84 36.2,6.1 36.45,6.1 | 36.45,6.48 36.45,6.35 36.45,5.84 v36.2,5.84 | 30.23,10.67 30.23,10.54 v30.61,10.54
  Top 0.813: 37.21,13.59 38.57,13.59 | v30.61,7.49 v30.61,10.54 v30.61,12.83 30.86,12.83 | v37.21,7.49 v37.21,8.26 v37.21,9.02 37.21,12.32 v37.21,12.83 | 43.92,12.68 v43.81,12.57 v43.18,12.57
  Top 1.016: C6.+ 26.6,5.37 28.96,5.37 30.23,6.86 | IC1.2 30.23,6.86 | 34.04,15.24 34.04,10.16 | 34.04,15.24 32.38,15.24 29.08,11.94 29.08,8.89 29.34,9.78 | 29.34,9.78 29.34,5.71 37.21,5.71 | 37.21,5.71 37.21,12.32 | 37.21,12.32 37.21,13.59 37.21,15.24 34.04,15.24 | 29.34,9.78 29.72,9.78 30.86,10.92 30.86,12.83 32.64,14.61 36.45,14.61 36.45,6.48 30.23,6.48 30.23,6.86 | 30.23,6.86 30.23,8.64 30.99,9.4 30.99,6.99 35.94,6.99 35.94,13.84 32.26,13.84 32,13.59 36.07,13.59 | 29.84,10.41 29.84,12.19 30.23,12.19 30.23,10.67 | 37.21,5.71 37.47,5.71 39.24,7.49 39.24,9.78 38.73,10.29 38.73,12.32 38.61,12.32 | 37.97,12.32 38.61,12.32 | 37.21,12.32 37.97,12.32 | 37.97,12.32 v37.97,11.68 v37.97,10.92 v37.97,10.16 v37.97,9.4 v37.97,8.64 v37.97,7.87 37.97,6.73 | 38.61,12.32 38.61,6.99 | 31.24,11.18 31.24,9.91 29.97,9.91 29.97,9.4 | 29.97,9.4 29.97,9.14 | v29.84,9.4 29.97,9.4
  Bottom 0.254: v54.48,29.72 54.48,30.1 | v41.66,14.1 41.7,14.1 42.16,13.63 42.16,13.84 42.29,13.97 42.29,14.35 | v58.8,39.12 57.41,39.12 v56.64,38.35 | 42.42,13.34 42.44,13.35 | 42.29,13.21 42.16,13.34 | 40.26,14.73 40.39,14.86 40.64,14.86 | 21.97,12.7 21.84,12.57 21.84,12.45 | 21.84,11.94 21.97,11.81 21.97,11.56 21.84,11.56 | 21.97,11.18 21.84,11.18 | 21.97,10.92 21.84,10.79 21.84,10.41 | 15.11,10.41 17.02,10.29 15.62,10.03 15.88,9.78 15.88,9.65 16.26,9.27 16.51,9.02 16.51,8.89 | 17.27,8.13 17.27,7.87 | 21.21,14.1 21.21,13.84 | v29.84,11.68 v29.84,12.45 | v29.84,10.92 30.23,10.54 v30.61,10.54 | 36.83,6.35 35.69,6.35 35.56,6.48 | v30.99,45.72 v30.99,43.94
  Bottom 0.305: 54.48,30.35 v55.37,31.24 | 54.48,30.35 v54.48,29.72 | 54.48,30.35 54.36,30.48 53.09,30.48 52.7,30.1 52.7,28.45 52.07,27.81 v51.82,27.81 | v51.56,15.75 49.91,14.1 v41.66,14.1
  Bottom 0.61: 22.35,32.38 21.21,31.24 14.22,31.24 v9.78,26.8 | 9.78,12.7 9.78,11.81 arc90 10.29,11.18 11.81,11.18 arc-90 17.02,6.35 | 17.02,6.35 17.45,9.86 | 17.45,9.86 19.81,7.49 v30.61,7.49 | 41.17,16.26 41.1,16.08 | 42.42,13.46 42.42,13.34 42.29,13.21 42.16,13.08 39.5,13.08 | 42.29,14.35 42.16,14.48 | 42.16,14.48 40.77,15.88 | 42.16,13.84 40.64,15.37 | 42.16,13.34 40.64,14.86 | 40.26,14.73 41.78,13.21 | 17.45,9.86 26.37,9.86 arc90 27.18,10.67 27.18,15.49 arc-90 27.94,16.26 41.17,16.26 | 41.17,16.26 42.42,15.01 42.42,13.46 | 42.42,13.46 arc-90 41.91,12.95 40.64,12.95 arc90 39.62,11.94 39.62,11.68 | 39.62,11.18 39.62,10.92 arc90 40.64,9.91 45.97,9.91 arc-90 46.74,9.14 | 42.67,5.59 42.67,4.83 arc-90 41.91,4.06 17.78,4.06 arc-90 17.02,4.83 17.02,5.08 | 46.74,6.48 arc-90 46.35,6.1 43.18,6.1 | 46.74,6.99 46.74,7.49 | 46.74,8.13 46.74,8.64 | 17.02,6.1 17.02,5.59 | 17.02,6.6 17.02,7.11 | 17.02,7.62 17.02,9.14 | 17.02,9.14 arc-90 17.78,9.91 27.18,9.91 | 27.18,9.91 27.94,9.91 | 27.94,9.91 27.94,7.48 | 17.02,9.14 46.74,9.14 | 46.74,9.14 46.74,8.64 | 46.74,8.64 17.27,8.64 17.27,8.13 46.74,8.13 | 46.74,7.49 46.74,8.13 | 17.02,7.62 46.74,7.49 | 17.02,7.11 17.02,7.62 | 17.02,7.11 46.74,6.99 | 46.74,6.48 46.74,6.99 | 17.02,6.6 46.74,6.48 | 17.02,6.35 17.02,6.6 | 17.02,6.35 17.02,6.1 | 17.02,6.1 43.18,6.1 | 43.18,6.1 arc90 42.67,5.59 | 17.02,5.59 42.67,5.59 | 17.02,5.59 17.02,5.08 | 17.02,5.08 42.42,5.08 42.42,4.57 17.53,4.57 17.27,7.87 | 17.27,7.87 17.14,9.53 | 17.14,9.53 42.16,9.4 42.16,9.65 39.62,9.65 39.62,9.91 27.94,9.91 | 27.18,9.91 27.18,10.16 39.62,10.16 39.62,10.67 27.43,10.67 27.43,11.18 39.62,11.18 | 39.62,11.18 39.62,11.68
  Bottom 0.61: 39.62,11.68 v29.84,11.68 27.43,11.68 27.43,12.19 39.37,12.19 39.37,12.45 | 39.37,12.45 39.62,12.45 | 39.37,12.45 v29.84,12.45 27.43,12.45 27.43,12.95 39.62,12.95 39.62,13.46 27.43,13.46 27.43,13.97 42.16,13.97 42.16,14.48 | 42.16,14.48 27.43,14.48 27.43,14.99 41.91,14.99 41.91,15.24 41.15,15.24 | 41.15,15.24 27.43,15.24 27.43,15.75 41.15,15.75 41.15,15.24 | 22.99,9.91 arc-90 21.97,10.92 21.97,11.18 21.97,11.56 21.97,12.7 | 21.97,13.34 21.97,12.95 | 21.97,12.95 21.97,12.7 | 21.97,13.34 arc90 21.21,14.1 13.84,14.1 arc90 13.08,13.34 13.08,13.46 arc-90 12.32,12.7 9.78,12.7 | v8.76,12.7 9.78,12.7 | 13.46,13.84 21.21,13.84 21.46,13.84 | 21.97,13.34 13.34,13.34 | 21.97,12.95 12.95,12.95 | 21.97,12.7 12.57,12.7 | 21.84,12.45 10.03,12.45 | 21.84,11.94 10.03,11.94 | 21.84,11.56 10.16,11.56 | 21.84,11.18 13.59,11.18 | 21.84,10.79 14.48,10.79 | 15.11,10.41 21.84,10.41 21.97,10.41 | 15.62,10.03 24.77,10.03 | 17.14,9.53 46.48,9.53 | 17.27,7.87 46.61,7.87 | 15.88,9.65 23.62,9.65 | 16.26,9.27 24,9.27 | 16.51,8.89 24.26,8.89
  Bottom 0.813: 38.1,6.6 37.97,6.6 v37.21,7.49 v37.21,8.26 v37.21,9.02 | v30.61,7.49 v30.61,8.26 v30.61,9.02 v30.61,9.78 v30.61,10.54 v30.61,11.3 | v30.61,12.06 v30.61,12.83 30.73,11.68 30.86,11.56 30.86,11.3 | v37.21,12.83 v37.21,12.06 v37.21,11.3 v37.21,10.54 v37.21,9.78 | v37.21,12.83 37.08,13.59 37.21,13.72 v37.21,12.83 | 43.22,12.57 v43.81,12.57 | 43.22,12.57 v43.18,12.57 | 43.22,12.57 42.44,13.35 42.16,13.63 37.88,13.63 v37.21,12.83 | H2.5 38.1,6.35 36.83,6.35 36.45,6.35 | H2.2 30.48,5.84 v32.38,5.84
  Bottom 1.016: 36.83,6.35 36.7,6.35 v36.2,5.84
A0  (via drill 0.4)
  Top 0.254: v57.91,26.92 58.29,27.3 58.29,28.2 IC5.23
  Bottom 0.254: v57.91,26.92 57.4,26.42 57.4,24.26 59.94,21.72 59.94,16 58.42,14.48 58.42,8.51 53.91,4 52.26,4 H3.1
A1  (via drill 0.4)
  Top 0.254: v59.56,27.05 59.06,27.55 IC5.24
  Bottom 0.254: v59.56,27.05 59.05,26.54 58.55,26.54 57.91,25.91 57.91,24.51 60.45,21.97 60.45,15.75 58.93,14.22 58.93,8.13 H3.2
A2  (via drill 0.4)
  Top 0.254: IC5.25 59.81,29.73 59.46,30.07 v58.55,30.07
  Bottom 0.254: v58.55,30.07 59.46,30.07 60.33,29.21 60.33,22.86 62.1,21.08 62.1,15.37 59.44,12.7 59.44,6.1 H3.3
A3  (via drill 0.4)
  Top 0.254: IC5.26 59.87,30.53 59.56,30.73 59.05,30.73 v58.55,30.99
  Bottom 0.254: v58.55,30.99 59.05,30.73 60.83,30.73 61.21,30.35 61.21,29.72 60.83,29.34 60.83,23.11 62.61,21.34 62.61,15.11 59.94,12.45 59.94,4.06 H3.4
A4_SDA  (via drill 0.4)
  Top 0.203: 50.55,30.48 50.04,29.97 50.04,27.43 49.45,26.85 v49.45,25.4
  Top 0.254: IC5.27 59.48,31.33 v59.31,31.5 | v50.29,35.05 50.29,34.04 50.55,33.78 50.55,30.48 | v38.61,49.02 37.85,49.78 37.08,49.78 36.58,49.28 v27.69,49.28
  Bottom 0.254: v59.31,31.5 61.09,31.5 61.85,30.73 61.85,29.59 61.34,29.08 61.34,23.37 63.12,21.59 63.12,13.08 62.99,12.95 62.99,10.54 63.25,10.29 63.25,4.83 H3.5 59.69,1.27 50.04,1.27 49.53,1.78 49.53,4.83 53.09,8.39 53.09,17.78 50.04,20.83 50.04,24.89 v49.45,25.4 | v50.29,35.05 49.53,35.81 49.53,38.1 46.74,40.89 45.7,40.89 43.43,43.16 43.43,44.96 42.67,45.72 40.39,45.72 SJ5.1 40.13,47.5 v38.61,49.02 | v27.69,49.28 26.16,49.28 25.91,49.53 24.89,49.53 24.64,49.28 22.86,49.28 H1.9
A5_SCL  (via drill 0.4)
  Top 0.203: v49.78,32.77 49.78,30.48 49.53,30.23 49.53,27.69 48.77,26.92 v48.77,26.42
  Top 0.254: IC5.28 61.34,32.13 61.98,31.5 v62.36,31.5 | v37.34,49.02 37.08,49.02 36.83,48.77 28.45,48.77 28.19,48.51 27.18,48.51 26.92,48.77 v25.4,48.77
  Bottom 0.254: v62.36,31.5 62.36,29.21 61.85,28.7 61.85,23.62 63.63,21.84 63.63,12.83 63.5,12.7 63.5,10.79 63.75,10.54 63.75,2.55 H3.6 61.72,0.76 49.78,0.76 49.02,1.52 49.02,5.09 52.58,8.64 52.58,17.53 49.53,20.57 49.53,24.13 48.77,24.89 v48.77,26.42 | 25.15,48.77 20.83,48.77 H1.10 | v49.78,32.77 49.02,33.53 49.02,37.85 46.48,40.39 40.39,40.39 38.61,42.16 38.61,45.72 38.35,45.97 SJ6.1 37.08,48.77 v37.34,49.02
  Bottom 0.305: 25.15,48.77 v25.4,48.77
ACTLED
  Top 0.254: IC6.20 40.58,25.42 43.6,22.4 RN1.2
AREF  (via drill 0.4)
  Top 0.254: IC5.20 55.86,29.36 v55.5,29.72 | v56.39,31.24 56.39,31.37 55.5,32.26 55.5,32.64 56.39,33.53 56.39,34.54 v56.77,34.92 | v49.78,48.51 49.53,48.26 28.7,48.26 28.45,48.01 24.89,48.01 23.88,49.02 | 23.88,49.02 H1.8 | C1.1 23.75,49.02 23.88,49.02
  Bottom 0.254: v55.5,29.72 55.5,30.1 56.39,30.99 v56.39,31.24 | v56.77,34.92 55.12,36.58 55.12,37.97 49.53,43.56 49.53,47.37 49.78,47.62 v49.78,48.51
COLLED
  Top 0.254: IC6.21 41.08,25.92 43,24 44.57,24 45,23.57 45,22 44.6,21.6 RN1.3
D0_RX  (via drill 0.4)
  Top 0.254: IC5.30 60.5,33.78 v58.29,33.78 | v17.14,48.77 17.14,49.4 17.53,49.78 17.53,52.32 17.91,52.7 61.59,52.7 H4.1 | v15.49,35.56 15,36.05 15,37 17.2,39.2 v18.8,39.2 | v3.81,47.88 4.39,48.46 RN3.4
  Bottom 0.203: v3.81,47.88 4.32,47.88 4.83,47.37 7.75,47.37 13.72,41.4 13.72,37.34 v15.49,35.56
  Bottom 0.254: v58.29,33.78 58.55,34.04 59.87,34.04 60.05,34.11 63.5,37.56 H4.1 | v18.8,39.2 18.8,42.7 17.14,44.35 v17.14,48.77
D1_TX  (via drill 0.4)
  Top 0.254: IC5.31 60.54,34.54 58.67,34.54 v58.42,34.8 | H4.2 59.56,52.2 20.7,52.2 20,51.5 v20,47.5 | v16,36.7 17.3,38 18.8,38 v20,39.2 | v3.68,48.9 4.04,49.26 RN3.3
  Bottom 0.203: v3.68,48.9 4.32,48.9 5.41,47.83 7.95,47.83 14.73,41.02 14.96,40.79 14.96,38.57 14.99,38.54 14.99,37.72 v16,36.7
  Bottom 0.254: v58.42,34.8 58.69,34.53 59.54,34.53 62.87,37.85 62.87,48.9 H4.2 | v20,47.5 v20,39.2
D2  (via drill 0.4)
  Top 0.254: IC5.32 60.53,35.31 v59.31,35.31
  Bottom 0.254: v59.31,35.31 59.33,35.33 59.41,35.33 62.23,38.15 62.23,46.99 H4.3
D3  (via drill 0.4)
  Top 0.254: IC5.1 59.82,36.83 v59.94,36.96
  Bottom 0.254: v59.94,36.96 61.59,38.61 61.59,45.09 H4.4
D4  (via drill 0.4)
  Top 0.254: v58.29,38.23 58.29,36.85 IC5.2 | v57.78,31.55 v57.78,32.97
  Bottom 0.254: v57.78,32.97 57.51,33.22 57.53,34.67 58.29,36.45 v58.29,38.23 59.82,38.23 60.96,39.37 60.96,43.18 H4.5 | v57.78,31.55 57.78,29.21 56.92,28.35 56.92,28.07 | SJ7.2 56.92,28.07 | 56.92,28.07 57.05,27.94
D5  (via drill 0.4)
  Top 0.254: IC5.9 51.99,35.31 v54.48,35.31
  Bottom 0.254: v54.48,35.31 54.48,37.85 48.9,43.43 48.9,48.26 48.9,48.64 48.9,48.9 H4.6
D6  (via drill 0.4)
  Top 0.254: IC5.10 51.98,34.54 52.83,34.54 53.09,34.8 53.85,34.8 54.23,34.42 v54.86,34.42
  Bottom 0.254: v54.86,34.42 54.23,34.42 53.72,34.92 53.72,37.85 48.26,43.31 H4.7
D7  (via drill 0.4)
  Top 0.254: IC5.11 53.16,33.73 v53.47,34.04
  Bottom 0.254: v53.47,34.04 53.09,34.42 53.09,37.72 47.62,43.18 47.62,48.26 47.62,48.64 47.62,48.9 H4.8
D8  (via drill 0.4)
  Top 0.254: IC5.12 52.7,32.89 53.06,33.25 54.12,33.26 v54.36,33.53
  Bottom 0.254: v54.36,33.53 54.1,33.27 52.96,33.27 52.45,33.78 52.45,37.47 46.99,42.93 46.99,48.39 45.97,49.4 44.7,49.4 43.31,50.8 H1.1
D9  (via drill 0.4)
  Top 0.254: IC5.13 52.7,32.13 53.09,32.51 v53.98,32.51
  Bottom 0.254: v53.98,32.51 52.32,32.51 51.82,33.02 51.82,37.21 46.35,42.67 46.35,48.13 45.72,48.77 44.45,48.77 43.81,49.4 40.01,49.4 39.12,50.29 H1.2
D10_CS  (via drill 0.4)  (1 unrouted)
  Top 0.254: IC5.14 52.87,31.33 v53.34,31.75
  Bottom 0.254: v53.34,31.75 53.21,31.88 49.61,31.88 48.5,32.99 48.5,37.5 46.5,39.5 40,39.5 35.81,43.69 34.29,43.69 34.04,43.94 34.04,47.24 36.58,49.78 H1.3
D11_MOSI  (via drill 0.4)  (2 unrouted)
  Top 0.203: IC5.15 51.36,30.53 50.8,29.97 v50.8,29.08 50.8,27.18 v50.16,26.54
  Top 0.254: IC5.15 56.72,30.53 57.91,29.34 59.44,29.34 62.1,26.67 64.52,26.67 | 64.52,26.67 64.58,26.67 | 64.52,26.67 65.74,27.89 P2.4 | RN6.6 53.61,26.65 v53.34,26.92
  Bottom 0.203: 50.42,29.08 v50.8,29.08
  Bottom 0.254: v53.34,26.92 52.96,26.54 v50.16,26.54 | 33.91,39.77 33.91,41.78 33.02,42.67 33.02,49.78 H1.4
D12_MISO  (via drill 0.4)  (2 unrouted)
  Top 0.203: v51.82,28.83 51.94,28.96 51.94,29.7 IC5.16
  Top 0.254: P4.7 62.9,12.16 62.87,12.19 v64.26,12.19
  Bottom 0.203: 50.42,28.32 51.18,28.32 v51.82,28.83 51.82,29.97 52.83,30.99 53.59,30.99 55.75,33.15 56.77,33.15 57.4,32.26 61.59,32.26 61.72,32.38 62.74,32.38 63.63,31.5 63.63,30.44 P2.1
  Bottom 0.254: v64.26,12.19 64.26,21.97 62.36,23.88 62.36,28.45 63.64,29.73 P2.1 | 33.4,39.39 33.4,41.27 32.51,42.16 32.51,49.78 H1.5
D13_SCK  (via drill 0.4)  (1 unrouted)
  Top 0.254: P2.3 64.9,29.15 64.9,29.21 | 64.9,29.21 64.9,30.99 66.17,32.26 66.17,33.02 65.91,33.27 65.15,33.27 64.77,32.89 63.5,32.89 63.25,33.15 63.25,34.04 62.55,34.73 Q2.1 | 53.46,28.32 52.45,27.3 52.45,26.8 52.83,26.42 52.83,26.09 RN6.7 | v53.47,29.59 v53.46,29.59 53.46,28.32 | 53.46,28.32 IC5.17 | 64.9,29.21 66.8,29.21 67.44,28.57 67.44,27.18 66.8,26.54 65.28,26.54 64.9,26.16 64.9,24.51 65.15,24.26 65.15,22.23 64.52,21.59 57.4,21.59 v56.52,22.48 | IC6.30 47.81,32.69 48.5,32 v48.5,30.5
  Bottom 0.203: v56.52,22.48 54.08,24.92 54.08,27.33 53.66,27.75 | 53.66,27.75 53.47,27.94 v53.47,29.59 arc91 53.46,29.46 IC5.17 | 51.05,27.05 52.28,27.05 52.98,27.75 53.66,27.75
  Bottom 0.254: 32.89,39.14 32.89,40.77 32,41.66 32,47.88 29.08,50.8 H1.6 | v48.5,30.5 48.5,29.61 51.05,27.05
D+  (1 unrouted)
  Top 0.254: J2.B6 5.15,37.35 5,37.5 5,38 5.35,38.35 J2.A6 10.09,38.35 Z1.1 10.5,38.74
D-  (via drill 0.4)  (1 unrouted)
  Top 0.254: J2.A7 8.15,37.85 v8.5,37.5 | J2.B7 8.1,38.85 v8.5,39.25 | v8.5,39.25 8.75,39.25 | v8.5,39.25 9.99,40.74 Z2.1
  Bottom 0.254: v8.5,37.5 v8.5,39.25
DTR  (via drill 0.4)  (1 unrouted)
  Top 0.254: v34.42,42.67 34.83,42.67 35.56,41.94 SJ3.1 | v9.65,51.69 v9.66,51.69
  Bottom 0.203: v9.65,51.69 9.65,51.49 SJ2.2 12.11,50.46 13.59,51.94 13.59,52.32 14.1,52.7 34.8,52.7 35.31,52.2
  Bottom 0.254: v34.42,42.67 33.53,43.56 33.53,48.01 35.31,49.78 35.31,52.2
FDXLED
  Top 0.254: IC6.19 40.08,25.27 43.5,21.85 43.5,21 43.7,20.8 RN1.4 45.57,19.49 RN2.8
GND  (via drill 0.4)  (116 unrouted)
  Top 0.254: C24.2 20.11,21.68 20.45,21.34 v22.35,21.34 22.99,21.34 | 22.99,21.34 24.64,21.34 v24.77,21.46 | 20.11,28.74 20.45,29.08 22.48,29.08 22.86,28.7 22.86,21.46 22.99,21.34 | RN8.1 57.22,6.92 57.28,6.86 58.02,6.86 | RN8.3 58.8,7.43 58.8,6.99 58.67,6.86 58.02,6.86 | RN8.2 58.02,6.86 | P4.6 61.73,13.22 v61.34,12.06 | Q2.2 62.55,32.83 63.12,32.26 65.15,32.26 v65.41,32.51 | IC5.21 56.66,29.57 v56.52,29.72 | v56.44,32.38 56.44,32.72 57.53,33.78 57.53,35.43 57.28,35.69 | v67.44,32.51 68.07,31.88 68.07,25.65 67.77,25.35 P2.6 | VR1.1 48.54,13.36 VR2.1 | IC6.26 45,30.69 | 45,30.69 45.19,30.69 | IC6.27 45.31,31.19 | IC6.28 45.5,31.69 v45.5,31 45,31 45,30.69
  Top 0.305: IC5.5 55.88,36.8 55.88,35.69 57.28,35.69 57.4,35.69 57.46,35.74 IC5.3 57.46,39.17 C27.2
  Top 0.406: C13.C 24.77,22.6 24.77,22.35 | v24.77,21.46 24.77,22.35 | 23.75,22.23 24.64,22.23 24.77,22.35 | v50.67,11.68 C29.2 | 38.61,15.37 38.61,15.49 37.85,16.26 36.7,16.26 36.2,16.76 IC1.1 | 38.61,15.37 C7.2 | 38.61,15.37 40.47,15.37 C9.2
  Top 0.61: 66.8,23.37 66.75,23.42 66.75,24.78 P2.6
  Top 1.016: IC1.1 34.32,17.5 v34.29,17.53
  Bottom 0.254: v56.52,29.72 57.15,30.35 57.15,31.24 56.9,32 v56.44,32.38 | v67.44,32.51 v65.41,32.51
  other vias: 65.66,4.45 47.76,2.54 58.28,40.38 58.29,20.7 58.29,19.94 23.7,47.12 2.54,51.82 44.58,16.13 45.34,16.13 35.05,17.53 27.94,38.23 35.31,46.99 42.42,46.61 2.29,30.99 1.02,48.01 51.18,22.1 51.94,22.1 65.15,20.7 65.15,19.94 50.8,36.32 65.02,50.8 52.2,48.51 5.21,25.78 47.76,1.65 25.91,2.29 47.76,5.21 49.26,7.1 55.24,11.05 55.24,12.7 24.13,27.18 23.24,27.18 15.11,28.32 13.34,26.04 14.99,23.5 11.3,26.04 11.3,24.26 21.46,21.34 20.57,21.34 19.68,21.34 19.05,15.11 18.03,15.11 17.02,15.11 16,15.11 54.36,11.05 54.36,12.7 60.83,6.73 17.02,1.78 17.78,1.78 31.24,46.74 45.22,43.66 34.8,45.47
  pour Bottom: 0,50.8 arc-74 2.54,53.34 63.5,53.34 arc-74 66.04,50.8 66.04,40.64 68.58,38.1 68.58,5.08 66.04,2.54 arc-74 63.5,0 2.54,0 arc-74 0,1.91
  pour Top: 0,50.8 arc-74 2.54,53.34 63.5,53.34 arc-74 66.04,50.8 66.04,40.64 68.58,38.1 68.58,5.08 66.04,2.54 arc-74 63.5,0 2.54,0 arc-74 0,1.91
LINKLED
  Top 0.254: IC6.17 39.08,24.42 42,21.5 42,18 42.95,17.05 RN2.4 44.57,17.05 44.98,17.46 44.98,17.48 45,17.5 45,18.22 45.43,18.65 RN2.7
MODE  (via drill 0.4)
  Top 0.254: IC6.25 46.74,30.19 R3.2 46.5,30.5 v46.5,31.5
  Bottom 0.254: v46.5,31.5 SJ4.1
N$1
  Top 0.305: RN5.6 21.84,24.87 21.84,24.13 | 21.84,24.13 21.12,24.13 RN5.5 | C24.1 21.84,22.61 21.84,24.13
N$2
  Top 0.254: C20.2 57.11,42.35 U$19.1 55.9,41.4 54.26,39.76 IC5.7
N$3
  Top 0.254: SJ3.2 37.59,42.42 C19.1
N$4
  Top 0.254: R8.2 61.63,37.5 62.36,38.23 LED10.C
N$5  (via drill 0.4)
  Top 0.254: IC7.1 36.51,43.76 R15.2 35.81,44.45 v35.05,44.45
  Bottom 0.254: SJ6.2 v35.05,44.45
N$6
  Top 0.254: R8.1 63.33,35.17 64.14,34.42 64.14,33.87 Q2.3
N$7
  Top 0.254: IC5.8 53.46,40.54 52.5,41.5 C21.2 54.1,44.34 U$19.3
N$9
  Top 0.254: Z1.2 11.43,36.31 11.43,32.89 10.79,32.26 7.02,32.26 R1.1 6.76,32.7 J2.FIX3 6.59,34.7 J2.A12B1 | Z2.2 R2.1 7.56,41.33 J2.A1B12 5.68,42.24 J2.FIX2 5.68,43.85 L3.1
  Bottom 0.254: J2.FIX3 J2.FIX4 J2.FIX1 J2.FIX2
N$10  (via drill 0.4)
  Top 0.254: R1.2 4.5,32 4,32.5 4,36 v3.5,36.5 | J2.B5 7.85,36.35 v8,36.5
  Bottom 0.254: v3.5,36.5 v8,36.5
N$11
  Top 0.254: LED6.C 3.01,47.01 2.79,47.22 2.79,49.28 3.17,49.66 3.68,49.66 4.08,50.06 RN3.2
N$12
  Top 0.254: RN4.5 33.2,43.25 33.02,43.43 32.51,43.43 | 32.51,43.43 32.38,43.31 32.38,42.6 RN4.6 | IC4.3 24.89,46.48 25.27,46.86 28.32,46.86 28.96,46.23 28.96,45.21 29.46,44.7 32,44.7 32.51,44.2 32.51,43.43
N$13
  Top 0.254: RN3.1 3.46,50.86 LED5.C
N$14  (via drill 0.4)
  Top 0.254: LED2.C 62.88,40.78 63.12,41.02 65.02,41.02 65.41,40.64 65.41,39.5 v65.91,38.99 | v56.64,23.5 56.77,23.62 v63.75,23.62 | RN6.8 51.85,25.4 v51.05,25.4
  Bottom 0.254: v65.91,38.99 65.91,38.35 64.01,36.45 64.01,32.77 65.15,31.62 66.8,31.62 67.44,30.99 67.44,24.51 66.55,23.62 v63.75,23.62 | v56.64,23.5 57.02,23.5 57.28,23.24 57.28,21.84 56.77,21.34 55.12,21.34 v51.05,25.4
N$15
  Top 0.406: 35.81,41.91 36.83,41.91
N$18
  Top 0.254: IC4.6 24.89,38.48 | 24.89,38.48 25.78,38.48 26.16,38.86 IC4.7 | 24.7,35.24 Q1.1 24.81,37.9 24.89,37.98 24.89,38.48
N$19
  Top 0.254: IC4.5 23.62,41.27 24.38,42.04 26.54,42.04 27.43,42.93 IC4.1
N$20  (via drill 0.4)
  Top 0.254: RN6.4 54.41,22.68 59.44,17.65 v61.21,17.65 62.46,17.65 P4.2 | RN8.8 57.22,11.5 v59.94,14.22
  Bottom 0.254: v59.94,14.22 61.21,15.49 v61.21,17.65
N$21
  Top 0.254: 56.9,26.54 56.9,26.92 57.46,27.5 IC5.22
  Top 0.305: 56.9,26.54 58.04,25.4 A7.1
N$22
  Top 0.254: 56.13,26.54 55.06,27.62 IC5.19
  Top 0.305: 56.13,26.54 A6.1
N$23
  Top 0.254: P4.CD1 55.61,11.83 56.01,11.43 56.01,6.59 56.9,5.7 61.2,5.7 61.98,6.48 CD.1
N$24
  Top 0.254: RN6.2 52.81,22.5 57.78,17.53 57.78,15.62 58.29,15.11 60.33,15.11 61.21,14.22 | 61.21,14.22 62.8,14.22 P4.5 | RN8.7 58.02,9.51 60.07,11.56 60.07,13.08 61.21,14.22
N$25
  Top 0.254: RN6.3 53.61,22.59 59.69,16.51 62.89,16.51 P4.3 64.77,16.51 65.15,16.13 65.15,11.94 64.26,11.05 64.26,10.29 64.01,10.03 59.44,10.03 58.82,9.42 RN8.6
N$26
  Top 0.254: LED8.C 46.48,18.29 46.04,17.85 RN2.6
N$27  (via drill 0.4)
  Top 0.254: RN6.5 54.41,26.35 v54.74,26.67
  Bottom 0.254: v54.74,26.67 54.74,27.69 SJ7.1
N$28
  Top 0.254: LED9.C 46.48,16.76 46.2,17.05 RN2.5
N$29  (via drill 0.4)
  Top 0.254: IC7.3 40.71,43.76 R14.2 41.4,44.45 v42.16,44.45
  Bottom 0.254: SJ5.2 v42.16,44.45
N$30
  Top 0.254: C15.1 27.71,29.26 U$17.1 29.12,30.67 35.36,30.67 IC6.11
N$32
  Top 0.254: U$17.3 30.29,27.74 C16.1 32,27.74 32.5,28.24 32.5,29.5 33.19,30.19 IC6.12
N$34
  Top 0.254: J2.A5 6.62,39.37 7.46,39.37 7.65,39.56 7.65,39.89 R2.2
N$35
  Top 0.254: R6.2 31.23,31.99 R7.1
N$36
  Top 0.254: R6.1 33.07,31.69 IC6.9
N$37
  Top 0.254: IC6.47 37.58,39.18 R9.1
N$39  (2 unrouted)
N$60
  Top 1.016: J1.PWR 14.46,10.67 19.05,10.67 21.38,12.99 D1.A
N$67  (via drill 0.4)
  Top 0.254: RN2.1 43.7,20.07 v43.31,20.07
  Bottom 0.254: U1.P$14 5.33,18.03 5.33,19.81 2.29,22.86 2.29,27.69 2.79,28.19 4.7,28.19 11.94,20.95 14.61,20.95 15.88,19.68 22.1,19.68 23.11,20.7 29.3,20.7 30,20 43.24,20 v43.31,20.07
N$68
  Top 0.813: U1.P$9 23.37,18.41 25.15,16.51 JP3.3
N$69
  Top 0.813: U1.P$10 14.99,17.14 15.75,16.38 22.73,16.38 25.15,13.97 JP3.2
N$115  (1 unrouted)
  Top 0.305: J2.A4B9 6.54,40.6 5.98,40.6 4.4,39.02 4.4,37.2 5.95,35.65
  Top 0.406: J2.A9B4 9.35,35.65 9.73,35.27 F1.1
N$321
  Top 0.305: RN5.7 21.84,25.67 21.84,26.42 | 21.84,26.42 21.12,26.42 RN5.8 | C23.1 21.84,27.94 21.84,26.42
N$327
  Top 0.254: LED7.C 46.3,20.77 46.27,20.8 RN1.5
N$328
  Top 0.254: LED4.C 46.35,21.34 46.09,21.6 RN1.6
N$329
  Top 0.254: LED3.C 46.61,22.86 46.15,22.4 RN1.7
N$332  (via drill 0.4)
  Top 0.254: RN2.2 43.67,18.69 v43.31,19.05
  Bottom 0.254: U1.P$12 3.54,25.67 3.68,25.53 13.34,15.88 17.27,15.88 19.18,17.78 28.32,17.78 30.04,19.5 41,19.5 41.5,19 43.26,19 v43.31,19.05
RESET  (via drill 0.4)  (1 unrouted)
  Top 0.203: RN4.2 31.6,41.76 31.75,41.91 34.29,41.91 34.42,41.78 34.42,40.89 34.67,40.64 37.97,40.64 38.14,40.81 C19.2
  Top 0.254: IC5.29 59.22,32.93 v59.05,33.02 | v52.32,4.95 52.2,4.95 51.18,3.94 40.13,3.94 39.37,3.17 39.37,1.91 38.73,1.27 34.29,1.27 H2.3 | v58.04,22.48 64.14,22.48 64.52,22.86 64.52,24 63.63,24.89 63.63,25.34 P2.5 | C19.2 39.79,40.81 40.26,40.39 41.78,40.39 42.55,41.15 42.55,42.8 46.35,46.61 61.39,46.61 62,46 62,43 | 64,41.91 63.09,41.91 62,43 | 64,41.91 S1.4 | v64.26,42.93 64.26,42.17 64,41.91 | 62,43 60.91,41.91 S1.3
  Bottom 0.254: P2.5 64.9,26.61 64.9,30.99 62.36,33.53 60.96,33.53 | v64.26,42.93 64.26,37.47 60.96,34.16 60.96,33.53 | v52.32,4.95 53.98,4.95 57.66,8.64 57.66,14.61 59.31,16.26 59.31,21.59 58.42,22.48 v58.04,22.48 | v59.05,33.02 59.56,33.53 60.96,33.53
RX_LED  (1 unrouted)
  Top 0.203: RN3.7 5.94,50.04
RXIN  (1 unrouted)
  Top 0.305: U1.P$2 17.4,27.3 19.03,25.67 RN5.2
  Bottom 0.254: 17.53,29.97 15.62,29.97 13.97,28.32 U1.P$2
RXIP  (1 unrouted)
  Top 0.305: U1.P$1 17.27,28.57 19.37,26.47 RN5.1
  Bottom 0.254: 29.34,28.57 U1.P$1
SPDLED
  Top 0.254: IC6.18 39.58,24.92 42.5,22 42.5,18.5 43,18 43.11,17.89 43.15,17.85 RN2.3
TX_LED  (1 unrouted)
  Top 0.203: RN3.8 5.97,50.87
TXON  (1 unrouted)
  Top 0.305: U1.P$6 17.4,22.23 19.25,24.07 RN5.4
  Bottom 0.254: U1.P$6 17.4,22.23 18.92,23.75 29.49,23.75
TXOP  (1 unrouted)
  Top 0.305: U1.P$5 17.89,24.87 RN5.3
  Bottom 0.254: 29.36,24.38 17.4,24.38 U1.P$5
USBGND  (via drill 0.4)
  Top 0.406: L3.2 6.86,44.45 v8.38,44.45
  Bottom 0.406: v8.38,44.45 8.38,43.69 4.51,43.69 4.01,44.19 3.66,44.19 SJ1.1
USBRXD  (1 unrouted)
  Top 0.254: RN3.5 6.01,48.51
USBTXD  (1 unrouted)
USBVCC
  Top 0.254: 13.72,35.11 13.33,34.72 F1.2
  Top 0.61: F1.2 13.63,32.11 14.36,31.11 22.86,31.11 23.62,31.88 25.74,31.88 27.01,33.15 Q1.3 27.05,34.16
VIN  (via drill 0.4)
  Top 0.254: RN4.3 32.4,40.79 31.88,40.26 v31.5,40.26 | v11.3,23.11 10.79,23.11 v9.65,21.97 | v11.18,19.93 11.18,17.91 13.21,15.88 13.21,13.45 12.45,12.7 11.17,12.7 8.89,10.42 8.89,7.11 10.67,5.33 12.95,5.33 15.89,8.27 C5.+
  Top 1.016: IC1.3 31.63,16.52 27.56,16.51 | 27.56,16.51 27.56,9.27 26.42,8.13 22.35,8.13 | JP3.4 27.56,19.05 27.56,16.51 | v22.86,2.16 22.35,2.16 | v21.84,2.16 22.35,2.16 | 22.35,2.16 22.35,5.84 22.1,6.1 D1.C 21.89,8.6 22.35,8.13 | C5.+ 17,8.13 22.35,8.13
  Bottom 0.254: v31.5,40.26 31.5,38.5 23.47,30.48 14.73,30.48 12.57,28.32 12.57,24.38 v11.3,23.11 | v9.65,21.97 11.18,20.45 v11.18,19.93
  Bottom 1.016: v21.84,2.16 v22.86,2.16 24.13,0.89 44.07,0.89 H2.8

### Text on the board
tPlace: USB | TX | RX | SCL | SDA | A | GND | 13 | 12 | 11 | 10 | 9 | 8 | 7 | 6 | 5 | 4 | 3 | 2 | 1 | 0 | REF | PWM | PWM | PWM | Digital | PWM | PWM | PWM | TX | RX | RST | RST-EN | PWR | D13 | 1 | 1 | ICSP | A6 | A7 | ACT | COL | EtherUno | FDX | D2INT | 100 | LNK | PoE | 7-48V | 7-12V | DC | microSD | C | D | 2.1mm | IO | Power | Analog | SDA | SCL | REF | RST | 3V3 | 5V | GND | GND | VIN | 0 | 1 | 2 | 3 | 4 | 5
bPlace: SCL | SDA | A | GND | 13 | 12 | 11 | 10 | 9 | 8 | 7 | 6 | 5 | 4 | 3 | 2 | 1 | 0 | UBOOT | I2C | REF | PWM | PWM | PWM | Digital | PWM | PWM | PWM | TX | RX | ISOLATE | SDA/SCL | GND | MCP 24AA025E48 I2C / ADDR: 70 (0x50) | EtherUno | v4.0 | by Jonathan Oxer | www.superhouse.tv/eu | CC | ROHS | SKU: ET | Power | Analog | SDA | SCL | RST | 3V3 | 5V | GND | GND | VIN | 0 | 1 | 2 | 3 | 4 | 5
tDocu: A | K | A | K | K | A | K | A | K | A | K | A | K | A | K | A | K | A